# EAGLE design HitconBadge2018 (EAGLE 8.4.3)
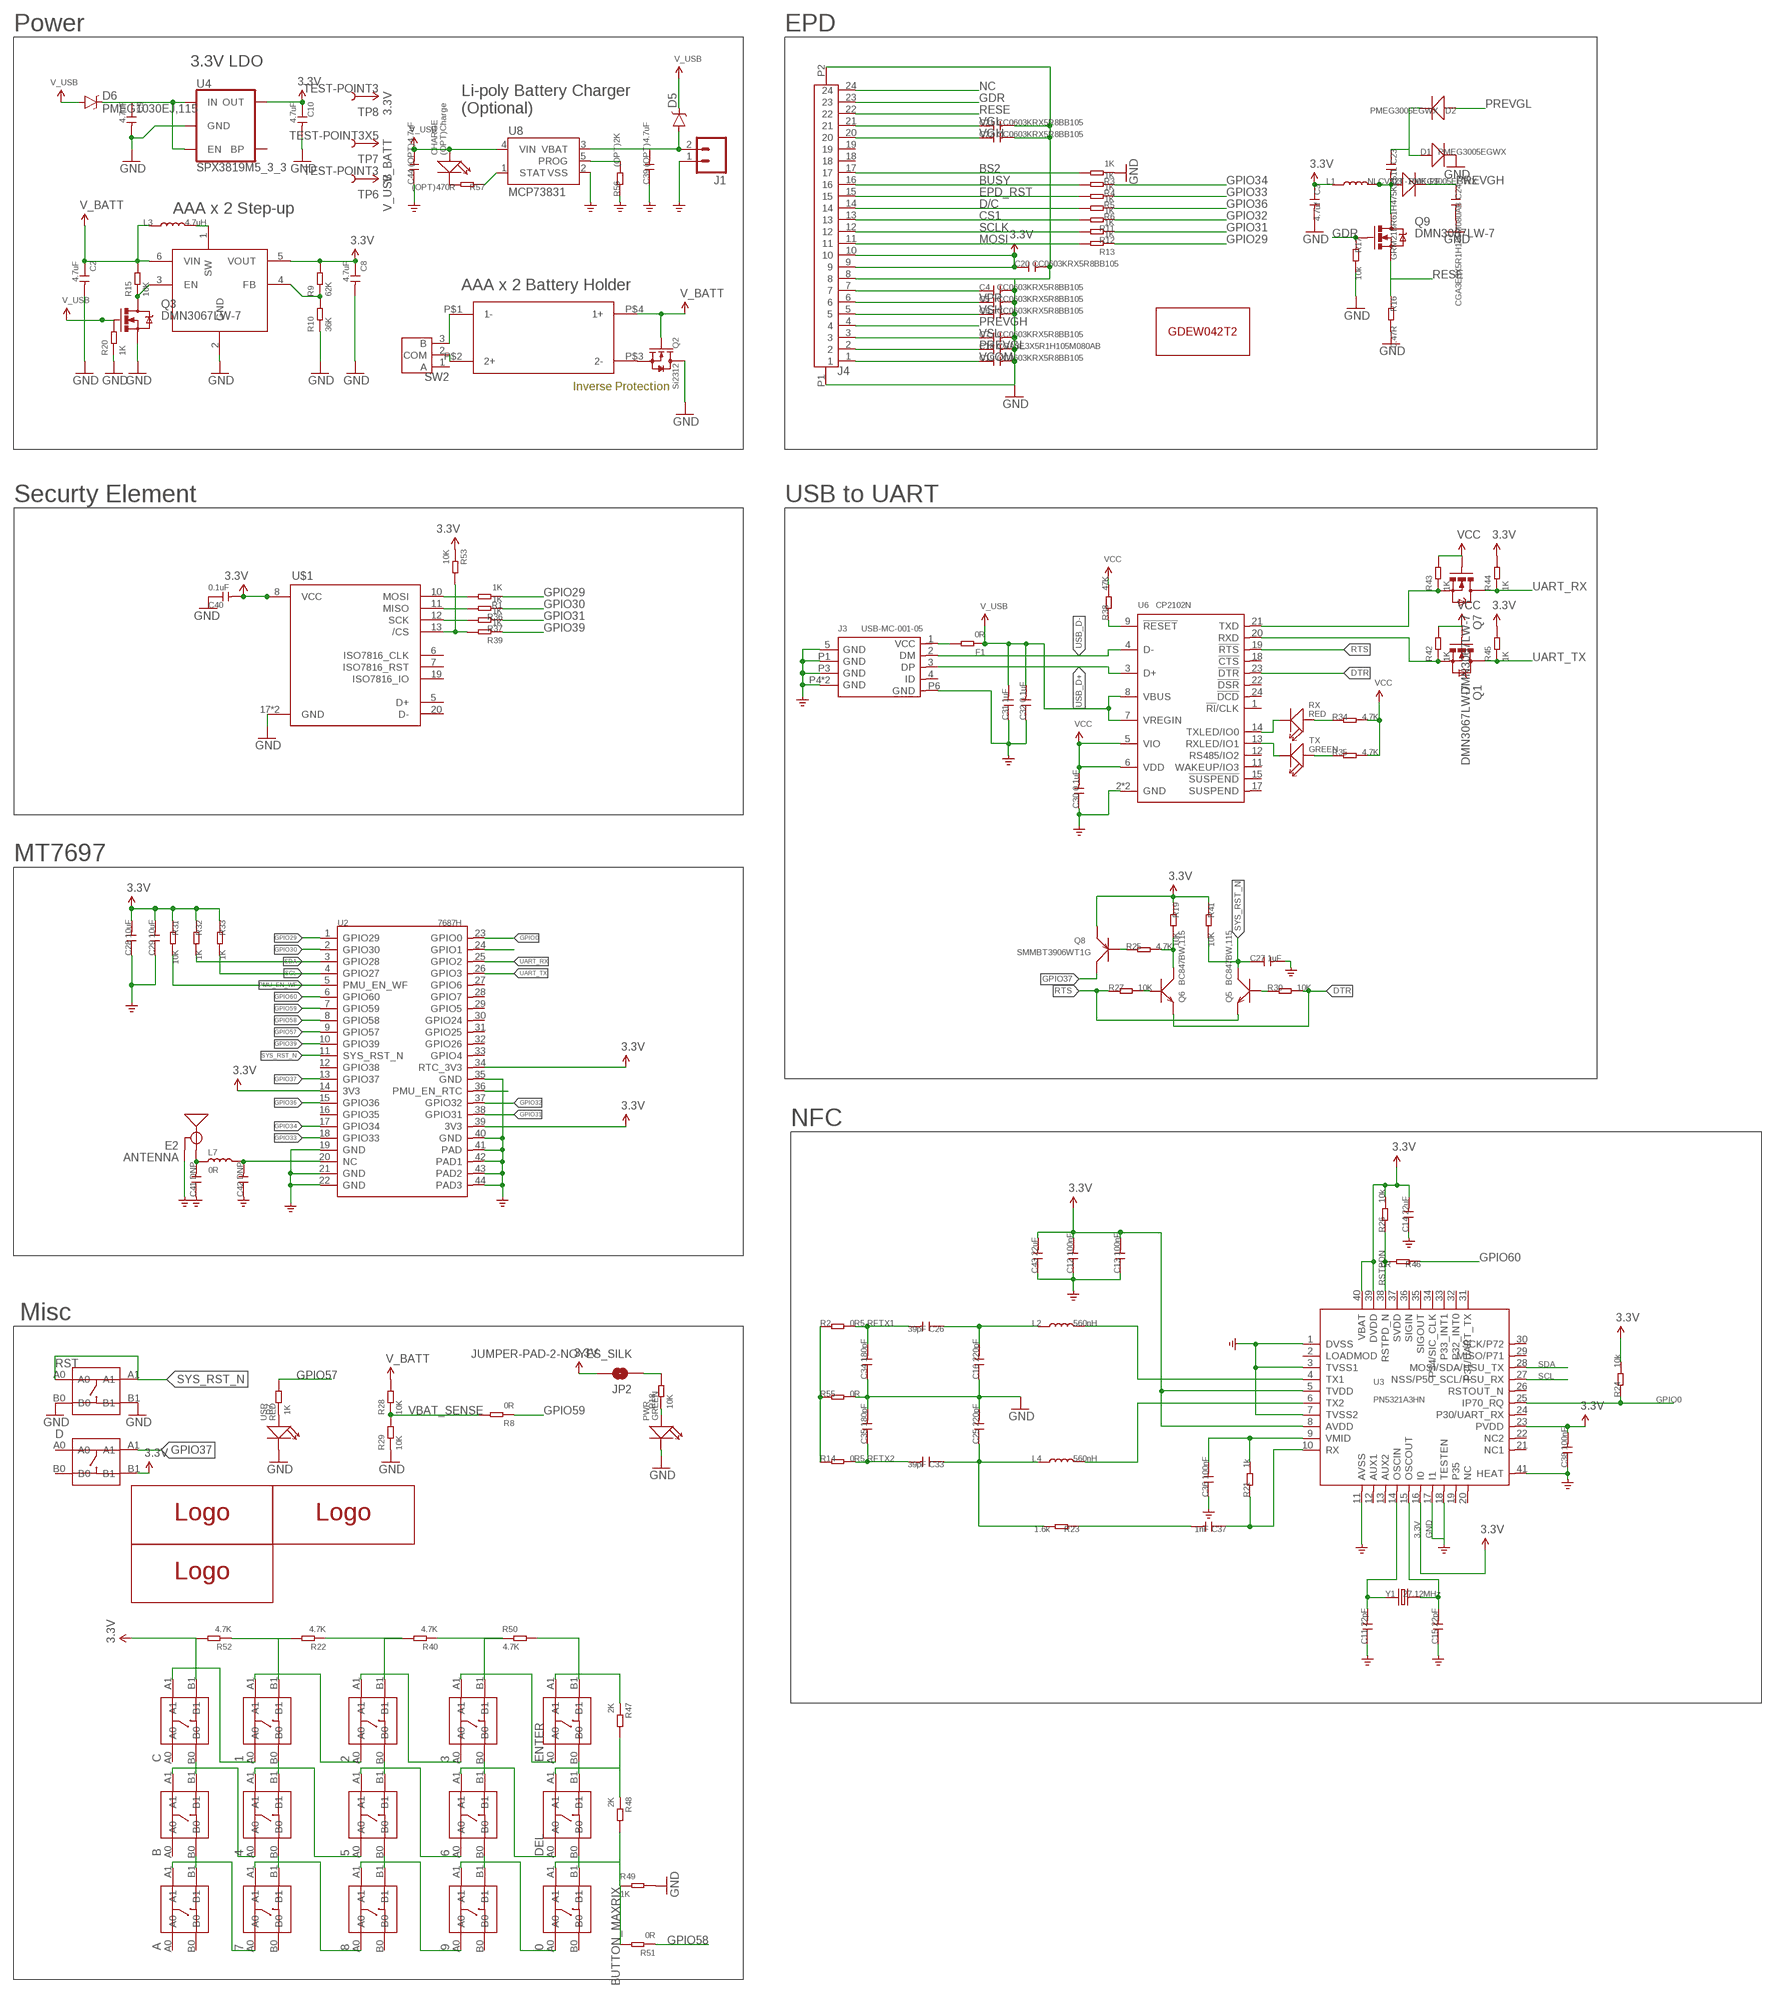
[diagram p0: schematic, sheet 1]

## Parts
0  BUTTON-4P-3.3X3.3  [4P-SMD-3.4X3.4X1.3H]
1  BUTTON-4P-3.3X3.3  [4P-SMD-3.4X3.4X1.3H]
2  BUTTON-4P-3.3X3.3  [4P-SMD-3.4X3.4X1.3H]
3  BUTTON-4P-3.3X3.3  [4P-SMD-3.4X3.4X1.3H]
4  BUTTON-4P-3.3X3.3  [4P-SMD-3.4X3.4X1.3H]
5  BUTTON-4P-3.3X3.3  [4P-SMD-3.4X3.4X1.3H]
6  BUTTON-4P-3.3X3.3  [4P-SMD-3.4X3.4X1.3H]
7  BUTTON-4P-3.3X3.3  [4P-SMD-3.4X3.4X1.3H]
8  BUTTON-4P-3.3X3.3  [4P-SMD-3.4X3.4X1.3H]
9  BUTTON-4P-3.3X3.3  [4P-SMD-3.4X3.4X1.3H]
A  BUTTON-4P-3.3X3.3  [4P-SMD-3.4X3.4X1.3H]
B  BUTTON-4P-3.3X3.3  [4P-SMD-3.4X3.4X1.3H]
C  BUTTON-4P-3.3X3.3  [4P-SMD-3.4X3.4X1.3H]
C2  4.7uF  CAP-0603  [C0603@1]
C3  4.7uf  C-0603  [C0603]
C4  CC0603KRX5R8BB105  C-0603  [C0603]
C5  CC0603KRX5R8BB105  C-0603  [C0603]
C6  CC0603KRX5R8BB105  C-0603  [C0603]
C7  CC0603KRX5R8BB105  C-0603  [C0603]
C8  4.7uF  CAP-0603  [C0603@1]
C9  4.7uF  CAP-0603  [C0603@1]
C10  4.7uF  CAP-0603  [C0603@1]
C11  22pF  C-0402  [C0402]
C12  100nF  C-0402  [C0402]
C13  100nF  C-0402  [C0402]
C14  22uF  C-0603  [C0603]
C15  22pF  C-0402  [C0402]
C16  220pF  C-0402  [C0402]
C18  CGA3E3X5R1H105M080AB  C-0603  [C0603]
C19  CC0603KRX5R8BB105  C-0603  [C0603]
C20  CC0603KRX5R8BB105  C-0603  [C0603]
C21  CC0603KRX5R8BB105  C-0603  [C0603]
C22  CC0603KRX5R8BB105  C-0603  [C0603]
C23  GRM21BR61H475KE51L  C-0805  [C0805]
C24  CGA3E3X5R1H105M080AB  C-0603  [C0603]
C25  220pF  C-0402  [C0402]
C26  39pF  C-0402  [C0402]
C27  1uF  C-0402  [C0402]
C28  10uF  C-0603  [C0603]
C29  10uF  C-0603  [C0603]
C30  0.1uF  C-0402  [C0402]
C31  1uF  C-0402  [C0402]
C32  0.1uF  C-0402  [C0402]
C33  39pF  C-0402  [C0402]
C34  180pF  C-0402  [C0402]
C35  180pF  C-0402  [C0402]
C36  100nF  C-0402  [C0402]
C37  1nF  C-0402  [C0402]
C38  100nF  C-0402  [C0402]
C39  (OPT)4.7uF  C-0603  [C0603]
C40  0.1uF  CAP-0402  [C0402@1]
C41  DNP  C-0402  [C0402]
C42  DNP  C-0402  [C0402]
C43  22uF  C-0603  [C0603]
C44  (OPT)4.7uF  C-0603  [C0603]
CHARGE  (OPT)Charge  LED'0603'  [LED-0603]
D  BUTTON-4P-3.3X3.3  [4P-SMD-3.4X3.4X1.3H]
D1  PMEG3005EGWX  D'1206'  [SOD123]
D2  PMEG3005EGWX  D'1206'  [SOD123]
D3  PMEG3005EGWX  D'1206'  [SOD123]
D5  (OPT)PMEG1030EJ,115  DIODE-SCHOTTKY-BAT20J  [SOD-323]
D6  PMEG1030EJ,115  DIODE-SCHOTTKY-BAT20J  [SOD-323]
DEL  BUTTON-4P-3.3X3.3  [4P-SMD-3.4X3.4X1.3H]
E2  ANTENNA  [2450AT18D0100E]
ENTER  BUTTON-4P-3.3X3.3  [4P-SMD-3.4X3.4X1.3H]
F1  0R  RES-0603  [R0603]
J1  M02-JST-2MM-SMT  [JST-2-SMD]
J3  USB-MC-001-05  MICRO-USB5+4P  [MICRO-USB5+5P-SMD-0.65-7.2X5.06MM]
J4  FPC-CONNECTOR-24P-0.5'ST-FPC-052024-B'  [24P-0.5]
JP2  JUMPER-PAD-2-NOYES_SILK  [PAD-JUMPER-2-NO_YES_SILK]
L1  NLCV32T-100K-PF  L'1813'  [1813@1]
L2  560nH  L'0603'  [L0603@1]
L3  4.7uH  L'1616BZ'  [1616BZ@1]
L4  560nH  L'0603'  [L0603@1]
L7  0R  INDUCTOR/FERRITE-BEAD-0402  [L0402]
PWR  GREEN  LED'0603'  [LED-0603]
Q1  DMN3067LW-7  MOSFET-NCHANNEL2N7002PW  [SOT323]
Q2  Si2312  MOSFET-N'SOT23'  [SOT23]
Q3  DMN3067LW-7  MOSFET-NCHANNEL2N7002PW  [SOT323]
Q5  BC847BW,115  TRANSISTOR-NPN-SOT323  [SOT-323]
Q6  BC847BW,115  TRANSISTOR-NPN-SOT323  [SOT-323]
Q7  DMN3067LW-7  MOSFET-NCHANNEL2N7002PW  [SOT323]
Q8  SMMBT3906WT1G  TRANSISTOR-PNP  [SOT-323]
Q9  DMN3067LW-7  MOSFET-NCHANNEL2N7002PW  [SOT323]
R1  1K  RES-0402  [R0402]
R2  0R5  R-0402  [R0402]
R3  1K  RES-0402  [R0402]
R4  1K  RES-0402  [R0402]
R5  1K  RES-0402  [R0402]
R6  1K  RES-0402  [R0402]
R7  1K  RES-0402  [R0402]
R8  0R  RES-0402  [R0402]
R9  62K  RES-0402  [R0402]
R10  36K  RES-0402  [R0402]
R11  1K  RES-0402  [R0402]
R12  1K  RES-0402  [R0402]
R13  1K  RES-0402  [R0402]
R14  0R5  R-0402  [R0402]
R15  10K  RES-0402  [R0402]
R16  0.47R  R-0402  [R0402]
R17  10k  R-0402  [R0402]
R18  10K  RES-0402  [R0402]
R19  10K  R-0402  [R0402]
R20  1K  RES-0402  [R0402]
R21  1k  R-0402  [R0402]
R22  4.7K  RES-0402  [R0402]
R23  1.6k  R-0402  [R0402]
R24  10k  R-0402  [R0402]
R25  4.7K  R-0402  [R0402]
R26  10k  R-0402  [R0402]
R27  10K  R-0402  [R0402]
R28  10K  RES-0402  [R0402]
R29  10K  RES-0402  [R0402]
R30  10K  R-0402  [R0402]
R31  10K  R-0402  [R0402]
R32  1K  R-0402  [R0402]
R33  1K  R-0402  [R0402]
R34  4.7K  R-0402  [R0402]
R35  4.7K  R-0402  [R0402]
R36  1K  RES-0402  [R0402]
R37  1K  RES-0402  [R0402]
R38  47K  R-0402  [R0402]
R39  1K  RES-0402  [R0402]
R40  4.7K  RES-0402  [R0402]
R41  10K  R-0402  [R0402]
R42  1K  RES-0402  [R0402]
R43  1K  RES-0402  [R0402]
R44  1K  RES-0402  [R0402]
R45  1K  RES-0402  [R0402]
R46  0R  R-0402  [R0402]
R47  2K  RES-0402  [R0402]
R48  2K  RES-0402  [R0402]
R49  1K  RES-0402  [R0402]
R50  4.7K  RES-0402  [R0402]
R51  0R  RES-0402  [R0402]
R52  4.7K  RES-0402  [R0402]
R53  10K  RES-0402  [R0402]
R55  0R  R-0402  [R0402]
R56  (OPT)2K  R-0402  [R0402]
R57  (OPT)470R  R-0402  [R0402]
RST  BUTTON-4P-3.3X3.3  [4P-SMD-3.4X3.4X1.3H]
RX  RED  LED'0603'  [LED-0603]
SW2  SWITCH-2H-3P'--'  [3P-2CH-3.54X8.5]
TP6  TEST-POINT3  [PAD.03X.03]
TP7  TEST-POINT3X5  [PAD.03X.05]
TP8  TEST-POINT3  [PAD.03X.03]
TX  GREEN  LED'0603'  [LED-0603]
U1  MCP1640  [SOT23-6]
U2  7687H  MODULE-SIP-AI7697H  [MODULE44P-1.6-18X18X1.3MM]
U3  PN5321A3HN  PN532-HVQFN40  [HVQFN40]
U4  SPX3819M5_3_3  V_REG_SPX3819-SOT23-5  [SOT23-5]
U6  CP2102N  CONVERTER-CP2102N(QFN24)  [QFN24G-0.5-4X4MM]
U8  MCP73831  [SOT23-5]
U$1  SLE97  [QFN-32]
U$2  HITCON_LOGOHITCON  [HITCON_LOGO]
U$3  HITCON_LOGOMEDIATEK  [MEDIATEK]
U$4  AAAX2  [AAAX2]
U$5  213  [213]
U$6  HITCON_LOGOIKV  [IKV]
USR  RED  LED'0603'  [LED-0603]
Y1  27.12MHz  CRYSTAL'3225'  [4P-SMD-3.2X2.5]

## Nets
3.3V: C3.1 C8.1 C10.1 C12.2 C13.2 C14.2 C20.1 C28.2 C29.2 C38.2 C40.2 C43.2 C.B1 D.B1 J4.9 J4.10 JP2.2 L1.1 Q8.2(E) R9.2 R19.1 R24.2 R26.2 R31.1 R32.1 R33.1 R41.1 R44.2 R45.2 R52.2 R53.1 TP8.P$1 U1.5(VOUT) U2.14(3V3) U2.34(RTC_3V3) U2.39(3V3) U3.5(TVDD) U3.8(AVDD) U3.16(I0) U3.23(PVDD) U3.39(DVDD) U3.40(VBAT) U4.5(OUT) U$1.8(VCC)
BS2: J4.17 R3.2
BUSY: J4.16 R4.2
BUTTON_MAXRIX: 0.A1 R48.2 R49.1 R51.2
CS1: J4.13 R11.2
D/C: J4.14 R6.2
DTR: Q6.2(E) R30.2 U6.23(!DTR!)
EPD_RST: J4.15 R5.2
GDR: J4.23 Q9.1(G) R17.1
GND: C2.2 C3.2 C4.2 C5.2 C6.2 C7.2 C8.2 C9.2 C10.2 C11.1 C12.1 C13.1 C14.1 C15.1 C16.1 C18.2 C19.2 C20.2 C21.2 C22.2 C24.2 C25.2 C27.2 C28.1 C29.1 C30.1 C31.1 C32.1 C34.1 C35.2 C36.1 C38.1 C39.1 C40.1 C41.1 C42.1 C43.1 C44.1 D1.- E2.GND@1(GND) E2.GND@2(GND) E2.GND@3(GND) J1.1 J3.5(GND) J3.P1(GND) J3.P3(GND) J3.P4(GND) J3.P5(GND) J3.P6(GND) J4.8 J4.P1 J4.P2 PWR.- Q2.3(D) Q3.2(S) R3.1 R10.1 R16.2 R17.2 R20.1 R29.1 R49.2 R55.2 R56.1 RST.B0 RST.B1 U1.2(GND) U2.19(GND) U2.21(GND) U2.22(GND) U2.35(GND) U2.40(GND) U2.41(PAD) U2.42(PAD1) U2.43(PAD2) U2.44(PAD3) U3.1(DVSS) U3.3(TVSS1) U3.7(TVSS2) U3.11(AVSS) U3.17(I1) U3.18(TESTEN) U3.41(HEAT) U4.2(GND) U6.2(GND) U6.PAD(GND) U8.2(VSS) U$1.17(GND) U$1.EP(GND) USR.- ; supply symbol labelled GND_POWER
GPIO0: R24.1 U2.23(GPIO0) U3.25(IP70_RQ)
GPIO29: R1.1 R13.1 U2.1(GPIO29)
GPIO30: R36.1 U2.2(GPIO30)
GPIO31: R12.1 R37.1 U2.38(GPIO31)
GPIO32: R11.1 U2.37(GPIO32)
GPIO33: R5.1 U2.18(GPIO33)
GPIO34: R4.1 U2.17(GPIO34)
GPIO36: R6.1 U2.15(GPIO36)
GPIO37: D.A1 Q8.3(C) U2.13(GPIO37)
GPIO39: R39.1 U2.10(GPIO39)
GPIO57: R7.2 U2.9(GPIO57)
GPIO58: R51.1 U2.8(GPIO58)
GPIO59: R8.1 U2.7(GPIO59)
GPIO60: R46.1 U2.6(GPIO60)
MOSI: J4.11 R13.2
N$1: C11.2 U3.14(OSCIN) Y1.2
N$2: L3.2 U1.1(SW)
N$3: U2.24(GPIO1)
N$4: C23.1 D1.+ D2.-
N$5: SW2.3(B) U$4.P$1(1-)
N$6: R7.1 USR.+
N$7: R9.1 R10.2 U1.4(FB)
N$8: Q3.3(D) R15.1 U1.3(EN)
N$9: C15.2 U3.15(OSCOUT) Y1.4
N$10: L4.2 U3.6(TX2)
N$11: L2.2 U3.4(TX1)
N$12: C4.1 J4.7
N$13: C16.2 C26.1 L2.1
N$14: C23.2 D3.+ L1.2 Q9.3(D)
N$15: C25.1 C33.1 L4.1 R23.2
N$16: C36.2 R21.2 U3.9(VMID)
N$17: C37.1 R21.1 U3.10(RX)
N$18: C37.2 R23.1
N$19: 4.B0 7.B1
N$20: C41.2 E2.FEED(SIGNAL) L7.1
N$21: 1.B0 4.B1
N$22: SW2.2(COM) U$4.P$2(2+)
N$23: C9.1 D6.C U4.1(IN) U4.3(EN)
N$24: R56.2 U8.5(PROG)
N$25: 5.B0 8.B1
N$26: C42.2 L7.2 U2.20(NC)
N$27: R1.2 U$1.10(MOSI)
N$28: R36.2 U$1.11(MISO)
N$29: R37.2 U$1.12(SCK)
N$30: R39.2 R53.2 U$1.13(/CS)
N$32: 2.B0 5.B1
N$33: 2.B1 R22.1 R40.2
N$34: 6.B0 9.B1
N$35: 3.B0 6.B1
N$36: 3.B1 R40.1 R50.1
N$37: 0.B1 DEL.B0
N$38: DEL.B1 ENTER.B0
N$39: ENTER.B1 R50.2
N$40: PWR.+ R18.1
N$41: JP2.1 R18.2
N$42: F1.2 J3.1(VCC)
N$43: Q5.1(B) R30.1
N$44: Q6.1(B) R27.2
N$45: Q6.3(C) R19.2 R25.2
N$46: Q8.1(B) R25.1
N$47: R35.1 TX.+
N$48: R34.1 RX.+
N$49: TX.- U6.13(RXLED/IO1)
N$50: RX.- U6.14(TXLED/IO0)
N$51: R38.1 U6.9(!RESET!)
N$52: Q1.2(S) R42.1 U6.20(RXD)
N$53: Q7.2(S) R43.1 U6.21(TXD)
N$54: 6.A1 DEL.A0
N$55: 3.A1 ENTER.A0
N$56: 7.A1 8.A0
N$57: 8.A1 9.A0
N$58: 0.A0 9.A1
N$59: 4.A1 5.A0
N$60: 5.A1 6.A0
N$61: DEL.A1 R47.2 R48.1
N$62: 1.A1 2.A0
N$63: 2.A1 3.A0
N$64: ENTER.A1 R47.1
N$65: R2.1 R14.1 R55.1
N$66: Q2.2(S) U$4.P$3(2-)
N$69: R57.1 U8.1(STAT)
N$70: CHARGE.- R57.2
N$71: 1.B1 R22.2 R52.1
N$72: C39.2 D5.A J1.2 U8.3(VBAT)
N$74: B.B1 C.B0
N$75: A.B1 B.B0
N$76: 7.A0 A.A1
N$77: 4.A0 B.A1
N$78: 1.A0 C.A1
NC: J4.24
PMU_EN_RTC: U2.36(PMU_EN_RTC)
PMU_EN_WF: R31.2 U2.5(PMU_EN_WF)
PREVGH: C24.1 D3.- J4.4
PREVGL: C18.1 D2.+ J4.2
RESE: J4.22 Q9.2(S) R16.1
RFTX1: C26.2 C34.2 R2.2
RFTX2: C33.2 C35.1 R14.2
RSTPDN: R26.1 R46.2 U3.38(RSTPD_N)
RTS: Q5.2(E) R27.1 U6.19(!RTS!)
SCL: R33.2 U2.4(GPIO27) U3.27(NSS/P50_SCL/HSU_RX)
SCLK: J4.12 R12.2
SDA: R32.2 U2.3(GPIO28) U3.28(MOSI/SDA/HSU_TX)
SYS_RST_N: C27.1 Q5.3(C) R41.2 RST.A0 RST.A1 U2.11(SYS_RST_N)
UART_RX: Q7.3(D) R44.1 U2.25(GPIO2)
UART_TX: Q1.3(D) R45.1 U2.26(GPIO3)
USB_D+: J3.3(DP) U6.3(D+)
USB_D-: J3.2(DM) U6.4(D-)
V_BATT: C2.1 L3.1 Q2.1(G) R15.2 R28.2 TP7.P$1 U1.6(VIN) U$4.P$4(1+)
V_USB: C31.2 C32.2 C44.2 CHARGE.+ D5.C D6.A F1.1 Q3.1(G) R20.2 TP6.P$1 U6.7(VREGIN) U6.8(VBUS) U8.4(VIN)
VBAT_SENSE: R8.2 R28.1 R29.2
VCC: C30.2 Q1.1(G) Q7.1(G) R34.2 R35.2 R38.2 R42.2 R43.2 U6.5(VIO) U6.6(VDD)
VCOM: C19.1 J4.1
VGH: C22.1 J4.20
VGL: C21.1 J4.21
VPP: C5.1 J4.6
VSH: C6.1 J4.5
VSL: C7.1 J4.3
Unconnected: 0.B0 7.B0 8.B0 9.B0 A.A0 A.B0 B.A0 C.A0 D.A0 D.B0 J3.4(ID) J4.18 J4.19 SW2.1(A) U2.12(GPIO38) U2.16(GPIO35) U2.27(GPIO6) U2.28(GPIO7) U2.29(GPIO5) U2.30(GPIO24) U2.31(GPIO25) U2.32(GPIO26) U2.33(GPIO4) U3.2(LOADMOD) U3.12(AUX1) U3.13(AUX2) U3.19(P35) U3.20(NC) U3.21(NC1) U3.22(NC2) U3.24(P30/UART_RX) U3.26(RSTOUT_N) U3.29(MISO/P71) U3.30(SCK/P72) U3.31(P31/UART_TX) U3.32(P32_INT0) U3.33(P33_INT1) U3.34(P34/SIC_CLK) U3.35(SIGOUT) U3.36(SIGIN) U3.37(SVDD) U4.4(BP) U6.1(!RI!/CLK) U6.11(WAKEUP/IO3) U6.12(RS485/IO2) U6.15(!SUSPEND!) U6.17(SUSPEND) U6.18(!CTS!) U6.22(!DSR!) U6.24(!DCD!) U$1.5(D+) U$1.6(ISO7816_CLK) U$1.7(ISO7816_RST) U$1.19(ISO7816_IO) U$1.20(D-)

## Notes on the sheet
- Power | EPD
- 3.3V LDO
- Li-poly Battery Charger
  (Optional)
- AAA x 2 Step-up
- AAA x 2 Battery Holder
- Inverse Protection
- Securty Element | USB to UART
- MT7697
- NFC
- Misc

## Library data of the parts
0 1-9 A B C D DEL ENTER RST = Discrete:BUTTON-4P
C2 C8-C10 C40 = Discrete:CAP: Ceramic Capacitors
C3-C7 C11-C16 C18-C39 C41-C44 = Discrete:C*: Ceramic Capacitors
CHARGE PWR RX TX USR = Discrete-small:LED
D1-D3 = Discrete:D*
D5 D6 = SparkFun-DiscreteSemi:DIODE-SCHOTTKY: Schottky diodes in SFE's production catalog BAT20J 1A 23V 0.62Vf RB751 120mA 40V 0.37Vf PMEG4005EJ 0.5A 40V 0.42Vf MBRA140 1A 40V 0.5Vf B340A 3A 40V SMA; PROD_ID: DIO-11623; VALUE: BAT20J
E2 = SparkFun-RF:ANTENNA: Chip antenna Chip antenna with ground or secondary connection. Common with larger metal RF connectors.
F1 R1 R3-R13 R15 R18 R20 R22 R28 R29 R36 R37 R39 R40 R42-R45 R47-R53 = Seeed-OPL-Resistor:RES
J1 = SparkFun-Connectors:M02: Standard 2-pin 0.1" header. Use with - straight break away headers ( PRT-00116) - right angle break away headers (PRT-00553) - swiss pins (PRT-00743) - machine pins (PRT-00117) - female headers (PRT-00115) Molex polarized connector foot print use with: PRT-08233 with associated crimp pins and housings. 2.54_SCREWTERM for use with PRT-10571. 3.5mm Screw Terminal footprints for PRT-08084 5mm Screw Terminal footprints for use with PRT-08432; PROD_ID: CONN-11443
J3 = Connector-new:MICRO-USB5+4P: 5+4P-SMD-0.65-B:320010000;5+2P-SMD-0.65-AB:340032001;5+5P-SMD-0.65-7.2X5.06MM:320010050;
J4 = Connector :FPC-CONNECTOR-24P-0.5
JP2 = SparkFun-Passives:JUMPER-PAD-2-NO
L1-L4 = Discrete:L*
L7 = Discrete:INDUCTOR/FERRITE-BEAD
Q1 Q3 Q7 Q9 = SparkFun-DiscreteSemi:MOSFET-NCHANNEL: Common NMOSFET Parts MFG P/N Store ID Prod ID FDD8780 TRANS-09984 SI7820DN TRANS-11055 FDS6630A IC-08089 2N7002PW TRANS-11151 FQP30N06L COM-10213 TRANS-10060 BSS123LT1G TRANS-08345 BSS138 TRANS-00830 BS170 2N7000; PROD_ID: TRANS-11151
Q2 = Discrete:MOSFET-N: IRLL014: http://www.vishay.com/docs/91319/sihll014.pdf
Q5 Q6 = Discrete-new:TRANSISTOR-NPN: NPN audion
Q8 = Discrete-new:TRANSISTOR-PNP: PNP audion
R2 R14 R16 R17 R19 R21 R23-R27 R30-R35 R38 R41 R46 R55-R57 = Discrete:R*
SW2 = Discrete:SWITCH-2H-3P
TP6-TP8 = SparkFun-Passives:TEST-POINT: Bare copper test points for troubleshooting or ICT
U1 = IC:MCP1640
U2 = template:MODULE-SIP-AI7697H
U3 = IC:PN532: NFC Controller http://www.adafruit.com/datasheets/pn532ds.pdf
U4 = SparkFun-IC-Power:V_REG_SPX3819: SPX3819 Voltage Regulator 3.3V 500mA, 16V input Datasheet <https://www.exar.com/content/document.ashx?id=22106> SparkFun Products: SparkFun Serial Controlled Motor Driver <https://www.sparkfun.com/products/13911>; PROD_ID: VREG-13321
U6 = template:CONVERTER-CP2102N(QFN24)
U8 = SparkFun-PowerIC:MCP73831: Miniature single cell, fully integrated Li-Ion, Li-polymer charge management controller http://ww1.microchip.com/downloads/en/DeviceDoc/20001984g.pdf IC-09995; PROD_ID: IC-09995
U$1 = SparkFun-DigitalIC:SLE97
U$2 U$3 U$6 = logo:HITCON_LOGO
U$4 = Battery:AAAX2
U$5 = EDP:213
Y1 = Discrete:CRYSTAL*: CRYSTAL

## Net classes
1 Power: width 0.762 mm

## Board
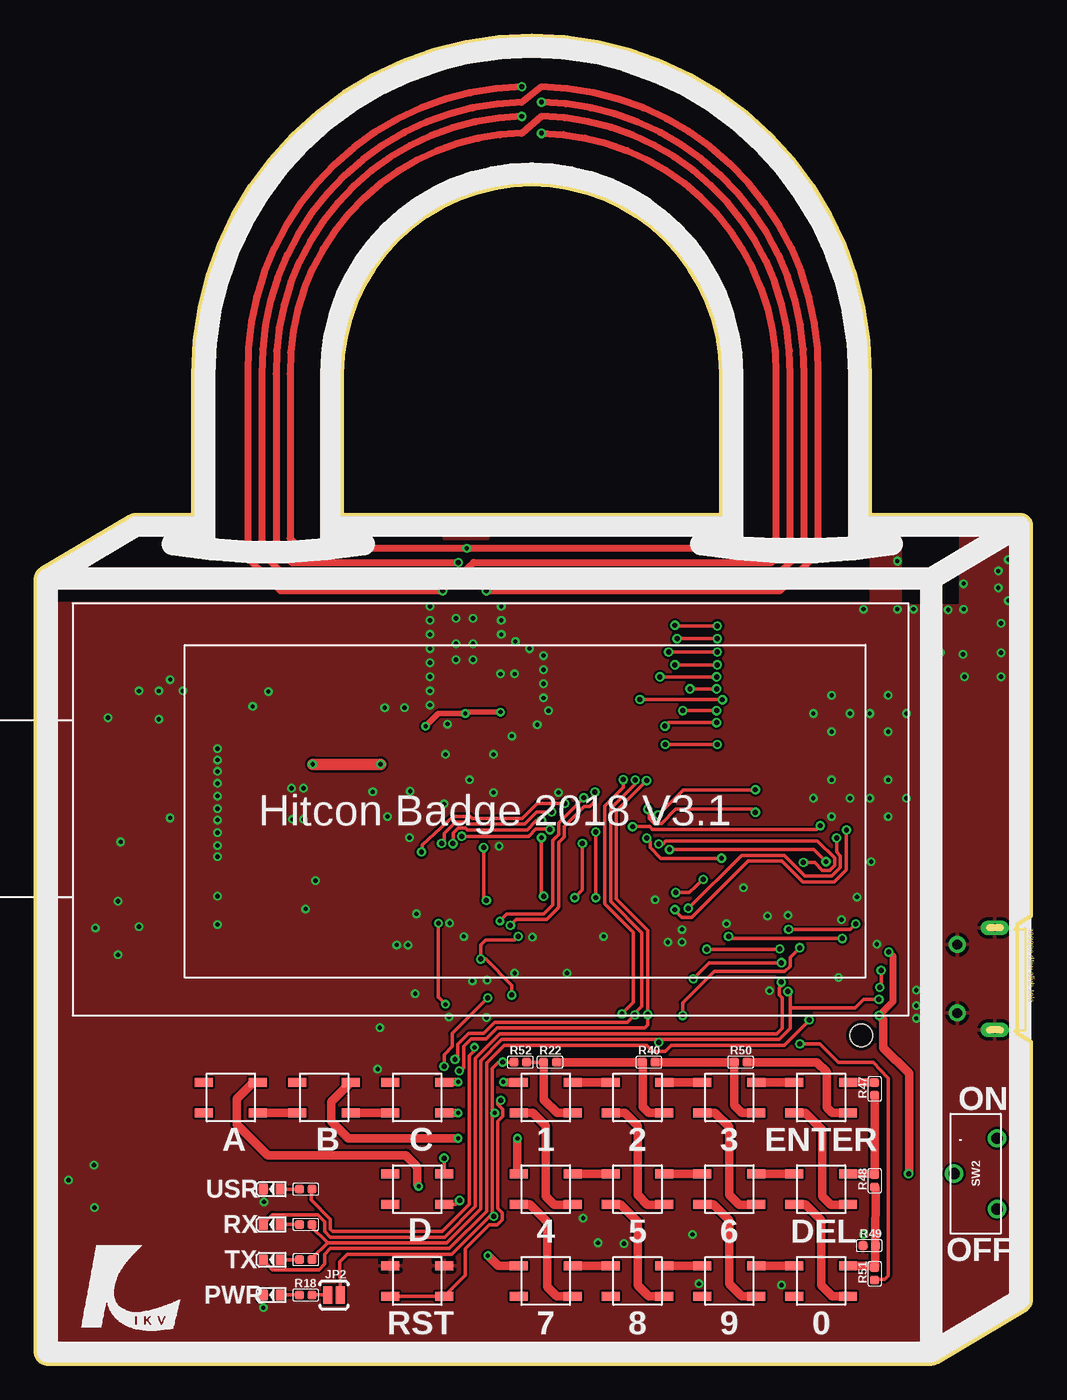
[diagram p1: board, top side]
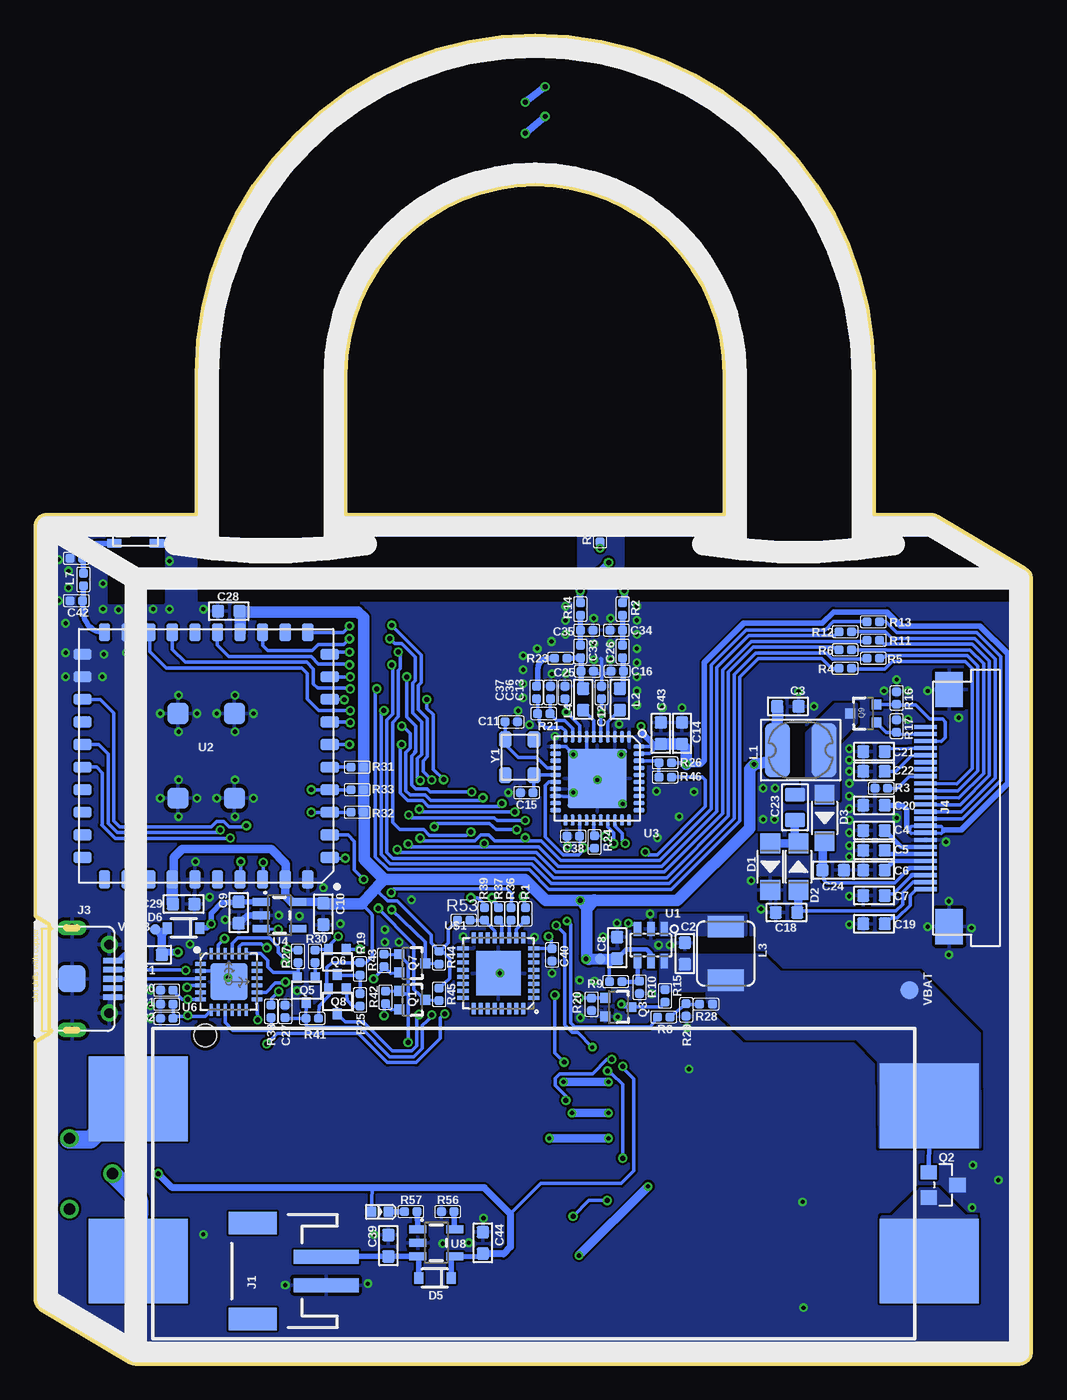
[diagram p2: board, bottom side, seen from below]

Size 70.55 x 94.15 mm. Coordinates in mm from the lower left corner, seen from the top.
Outline: 6.65,60.05 0.5,56.4 arc65 0,55.6 0,0.9 arc90 0.9,0 63.25,0 arc32 63.9,0.15 70.2,3.9 arc56 70.55,4.65 70.55,22.85 69.55,23.45 69.55,31.15 70.55,31.75 70.55,59.4 arc90 69.7,60.2 59.15,60.2 59.15,70.15 arc180 11.15,70.15 11.15,60.2 7.15,60.2 arc32 6.65,60.05
Outline: 48.55,60.2 21.75,60.2 21.75,70.15 arc-180 48.55,70.15 48.55,60.2
Copper layers (1*16): Top 0.035mm / dielectric 1.5mm / Bottom 0.035mm
Design rules "SeeedStudio_2layer_DRU_no_angle_20140221 *": minimum track width 6mil, minimum drill 0.3mm, track to track 6mil, track to pad 6mil, pad to pad 6mil, via to via 6mil, smd to smd 0mil, copper to edge 10mil, drill to drill 10mil, minimum pad ring 10mil, minimum via ring 6mil, stop-mask expansion 2mil, vias tented up to drill 100mil, thermal gap 10mil
tRestrict: area 61.5,54 to 65.3,60.2
bRestrict: area 61.5,54 to 65.3,60.2; area 19.6,29.2 to 23.7,30.2; area 16.1,41.5 to 17.1,45.6

### Footprints (pad centres in the part's own frame; a part is rotated, then mirrored left to right if it is on the bottom)
4P-SMD-3.4X3.4X1.3H = smd 1.27 x 0.635: A0 -1.905,1.079; A1 1.905,1.079; B0 -1.905,-1.079; B1 1.905,-1.079
C0603@1 = smd 0.889 x 0.889: 1 -0.762,0; 2 0.762,0
C0603 = smd 0.889 x 0.889: 1 -0.762,0; 2 0.762,0
C0402 = smd 0.635 x 0.635: 1 -0.445,0; 2 0.445,0
C0805 = smd 1.016 x 1.397: 1 -0.889,0; 2 0.889,0
C0402@1 = smd 0.635 x 0.635: 1 -0.445,0; 2 0.445,0
LED-0603 = smd 0.696 x 0.762: + -0.602,0; - 0.602,0
SOD123 = smd 1.397 x 1.397: + -1.651,0; - 1.651,0
SOD-323 = smd 0.63 x 0.83: A 1.15,0; C -1.15,0
2450AT18D0100E = smd 1 x 0.6: FEED 0.5,0.25; GND@1 0.5,1.55; GND@2 3.5,1.55; GND@3 3.5,0.25
R0603 = smd 0.889 x 0.889: 1 0,0.762; 2 0,-0.762
JST-2-SMD = smd 1 x 4.6: 1 -1,-3.7; 2 1,-3.7 | smd 1.6 x 3.4: NC1 -3.4,1.5; NC2 3.4,1.5
MICRO-USB5+5P-SMD-0.65-7.2X5.06MM = smd 0.4 x 1.35: 1 -1.3,2.875; 2 -0.65,2.875; 3 0,2.875; 4 0.65,2.875; 5 1.3,2.875 | smd 1.9 x 1.9: P1 0,0 | drill 0.508 pad 1.016 long: P3 -3.625,0; P4 3.625,0 | drill 0.7: P5 -2.425,2.65; P6 2.425,2.65
24P-0.5 = smd 0.3 x 1.6: 1 -5.75,0.05; 2 -5.25,0.05; 3 -4.75,0.05; 4 -4.25,0.05; 5 -3.75,0.05; 6 -3.25,0.05; 7 -2.75,0.05; 8 -2.25,0.05; 9 -1.75,0.05; 10 -1.25,0.05; 11 -0.75,0.05; 12 -0.25,0.05; 13 0.25,0.05; 14 0.75,0.05; 15 1.25,0.05; 16 1.75,0.05; 17 2.25,0.05; 18 2.75,0.05; 19 3.25,0.05; 20 3.75,0.05; 21 4.25,0.05; 22 4.75,0.05; 23 5.25,0.05; 24 5.75,0.05 | smd 2.5 x 1.95: P1 -8.4,-1.625; P2 8.4,-1.625
PAD-JUMPER-2-NO_YES_SILK = smd 0.635 x 1.27: 1 -0.45,0; 2 0.45,0
1813@1 = smd 1.778 x 3.81: 1 -1.651,0; 2 1.651,0
L0603@1 = smd 0.889 x 0.889: 1 -0.762,0; 2 0.762,0
1616BZ@1 = smd 1.524 x 2.54: 1 -1.905,0; 2 1.905,0
L0402 = smd 0.635 x 0.635: 1 -0.445,0; 2 0.445,0
SOT323 = smd 0.7 x 0.7: 1 -0.65,-0.925; 2 0.65,-0.925; 3 0,0.925
SOT23 = smd 1.016 x 1.143: 1 -0.889,-1.016; 2 0.889,-1.016; 3 0,1.016
SOT-323 = smd 0.635 x 0.762: 1 -0.635,-0.889; 2 0.635,-0.889; 3 0,0.889
R0402 = smd 0.635 x 0.635: 1 0,0.445; 2 0,-0.445
R0402' = smd 0.635 x 0.635: 1 -0.445,0; 2 0.445,0
3P-2CH-3.54X8.5 = drill 0.8 pad 1.3: 1 -2.5,-1.52; 2 0,1.52; 3 2.5,-1.52
PAD.03X.03 = smd 0.762 x 0.762: P$1 0,0
PAD.03X.05 = smd 1.27 x 1.27: P$1 0,0
SOT23-6 = smd 0.508 x 1.016: 1 -0.95,-1.143; 2 0,-1.143; 3 0.95,-1.143; 4 0.95,1.143; 5 0,1.143; 6 -0.95,1.143
MODULE44P-1.6-18X18X1.3MM = smd 1.3 x 0.8: 1 -8.75,7.2; 2 -8.75,5.6; 3 -8.75,4; 4 -8.75,2.4; 5 -8.75,0.8; 6 -8.75,-0.8; 7 -8.75,-2.4; 8 -8.75,-4; 9 -8.75,-5.6; 10 -8.75,-7.2; 21 8.75,-7.2; 22 8.75,-5.6; 23 8.75,-4; 24 8.75,-2.4; 25 8.75,-0.8; 26 8.75,0.8; 27 8.75,2.4; 28 8.75,4; 29 8.75,5.6; 30 8.75,7.2 | smd 0.8 x 1.3: 11 -7.2,-8.75; 12 -5.6,-8.75; 13 -4,-8.75; 14 -2.4,-8.75; 15 -0.8,-8.75; 16 0.8,-8.75; 17 2.4,-8.75; 18 4,-8.75; 19 5.6,-8.75; 20 7.2,-8.75; 31 7.2,8.75; 32 5.6,8.75; 33 4,8.75; 34 2.4,8.75; 35 0.8,8.75; 36 -0.8,8.75; 37 -2.4,8.75; 38 -4,8.75; 39 -5.6,8.75; 40 -7.2,8.75 | smd 1.5 x 1.5: 41 -2,3; 42 -2,-3; 43 2,-3; 44 2,3
HVQFN40 = smd 0.8 x 0.3: 1 -2.95,2.25; 2 -2.95,1.75; 3 -2.95,1.25; 4 -2.95,0.75; 5 -2.95,0.25; 6 -2.95,-0.25; 7 -2.95,-0.75; 8 -2.95,-1.25; 9 -2.95,-1.75; 10 -2.95,-2.25; 21 2.95,-2.25; 22 2.95,-1.75; 23 2.95,-1.25; 24 2.95,-0.75; 25 2.95,-0.25; 26 2.95,0.25; 27 2.95,0.75; 28 2.95,1.25; 29 2.95,1.75; 30 2.95,2.25 | smd 0.3 x 0.8: 11 -2.25,-2.95; 12 -1.75,-2.95; 13 -1.25,-2.95; 14 -0.75,-2.95; 15 -0.25,-2.95; 16 0.25,-2.95; 17 0.75,-2.95; 18 1.25,-2.95; 19 1.75,-2.95; 20 2.25,-2.95; 31 2.25,2.95; 32 1.75,2.95; 33 1.25,2.95; 34 0.75,2.95; 35 0.25,2.95; 36 -0.25,2.95; 37 -0.75,2.95; 38 -1.25,2.95; 39 -1.75,2.95; 40 -2.25,2.95 | smd 4.2 x 4.2: 41 0,0
SOT23-5 = smd 0.55 x 1.2: 1 -0.95,-1.3; 2 0,-1.3; 3 0.95,-1.3; 4 0.95,1.3; 5 -0.95,1.3
QFN24G-0.5-4X4MM = smd 0.8 x 0.26: 1 -2,1.25; 2 -2,0.75; 3 -2,0.25; 4 -2,-0.25; 5 -2,-0.75; 6 -2,-1.25; 13 2,-1.25; 14 2,-0.75; 15 2,-0.25; 16 2,0.25; 17 2,0.75; 18 2,1.25 | smd 0.26 x 0.8: 7 -1.25,-2; 8 -0.75,-2; 9 -0.25,-2; 10 0.25,-2; 11 0.75,-2; 12 1.25,-2; 19 1.25,2; 20 0.75,2; 21 0.25,2; 22 -0.25,2; 23 -0.75,2; 24 -1.25,2 | smd 2.6 x 2.6: PAD 0.02,-0.01
QFN-32 = smd 0.285 x 0.8: 1 -1.75,-2.5; 2 -1.25,-2.5; 3 -0.75,-2.5; 4 -0.25,-2.5; 5 0.25,-2.5; 6 0.75,-2.5; 7 1.25,-2.5; 8 1.75,-2.5; 17 1.75,2.5; 18 1.25,2.5; 19 0.75,2.5; 20 0.25,2.5; 21 -0.25,2.5; 22 -0.75,2.5; 23 -1.25,2.5; 24 -1.75,2.5 | smd 0.8 x 0.285: 9 2.5,-1.75; 10 2.5,-1.25; 11 2.5,-0.75; 12 2.5,-0.25; 13 2.5,0.25; 14 2.5,0.75; 15 2.5,1.25; 16 2.5,1.75; 25 -2.5,1.75; 26 -2.5,1.25; 27 -2.5,0.75; 28 -2.5,0.25; 29 -2.5,-0.25; 30 -2.5,-0.75; 31 -2.5,-1.25; 32 -2.5,-1.75 | smd 3.15 x 3.15: EP 0,0
AAAX2 = smd 7 x 6: P$1 -1,17; P$2 -1,5.5; P$3 55,5.5; P$4 55,16.5 | hole 1.6: 3.75,21.5
4P-SMD-3.2X2.5 = smd 1.143 x 0.889: 1 -1.27,1.016; 2 -1.27,-1.016; 3 1.27,-1.016; 4 1.27,1.016

### Placement (x,y rotation side)
0  55.65,5.9 0 top
1  36.15,18.9 0 top
2  42.65,18.9 0 top
3  49.15,18.9 0 top
4  36.15,12.4 0 top
5  42.65,12.4 0 top
6  49.15,12.4 0 top
7  36.15,5.9 0 top
8  42.65,5.9 0 top
9  49.15,5.9 0 top
A  13.85,18.9 0 top
B  20.45,18.9 0 top
C  27.05,18.9 0 top
C2  24.55,29.1 90 bottom
C3  17.25,46.6 0 bottom
C4  11.15,37.8 180 bottom
C5  11.15,36.4 180 bottom
C6  11.15,35 180 bottom
C7  11.15,33.2 180 bottom
C8  29.35,29.5 90 bottom
C9  56.15,32 270 bottom
C10  50.15,31.9 270 bottom
C11  36.85,45.5 180 bottom
C12  30.45,47.6 270 bottom
C13  33.05,47.6 270 bottom
C14  24.75,44.7 270 bottom
C15  35.75,40.5 0 bottom
C16  29.35,49.1 0 bottom
C18  17.35,32 180 bottom
C19  11.15,31.2 180 bottom
C20  11.15,39.6 180 bottom
C21  11.15,43.4 180 bottom
C22  11.15,42 180 bottom
C23  16.75,39.45 90 bottom
C24  14.05,35 0 bottom
C25  31.45,49.1 0 bottom
C26  28.95,50.5 90 bottom
C27  52.85,25 90 bottom
C28  56.85,53.35 0 bottom
C29  60.05,32.6 180 bottom
C30  61.25,26.5 0 bottom
C31  61.25,25.5 0 bottom
C32  61.25,24.5 0 bottom
C33  31.95,50.5 90 bottom
C34  29.4,52 0 bottom
C35  31.5,52 0 bottom
C36  34.05,47.6 270 bottom
C37  35.05,47.6 90 bottom
C38  32.45,37.4 0 bottom
C39  45.55,8.4 270 bottom
C40  33.95,29 90 bottom
C41  67.65,57.1 0 bottom
C42  67.65,54.1 0 bottom
C43  26.25,44.7 270 bottom
C44  38.85,8.6 270 bottom
CHARGE  46.15,10.8 0 bottom
D  27.05,12.4 0 top
D1  18.5,35.25 270 bottom
D2  16.5,35.25 90 bottom
D3  14.65,38.7 270 bottom
D5  42.25,6.1 180 bottom
D6  60.05,30.9 180 bottom
DEL  55.65,12.4 0 top
E2  65.45,57.9 0 bottom
ENTER  55.65,18.9 0 top
F1  62.35,29 270 bottom
J1  53.65,6.6 90 bottom
J3  67.95,27.3 270 bottom
J4  7.45,39.4 90 bottom
JP2  21.15,4.9 0 top
L1  16.35,43.5 0 bottom
L2  29.15,47.1 270 bottom
L3  21.65,29.1 90 bottom
L4  31.75,47.1 270 bottom
L7  67.15,55.6 270 bottom
PWR  16.75,4.9 180 top
Q1  43.85,25.8 270 bottom
Q2  6.25,12.7 270 bottom
Q3  29.25,25.3 270 bottom
Q5  51.35,26.5 180 bottom
Q6  49.15,28.5 180 bottom
Q7  43.85,28.4 270 bottom
Q8  49.15,25.7 180 bottom
Q9  11.9,46.1 90 bottom
R1  35.85,31.9 0 bottom
R2  0R5  [R0402']  28.95,53.5 270 bottom
R3  10.65,40.8 90 bottom
R4  13.2,49.3 90 bottom
R5  11.2,50 90 bottom
R6  13.2,50.6 90 bottom
R7  19.15,12.4 90 top
R8  26.05,24.6 90 bottom
R9  29.45,27.1 270 bottom
R10  27.75,26.7 180 bottom
R11  11.2,51.3 90 bottom
R12  13.2,51.9 90 bottom
R13  11.2,52.6 90 bottom
R14  0R5  [R0402']  31.95,53.5 270 bottom
R15  25.95,26.1 180 bottom
R16  0.47R  [R0402']  9.55,47.2 90 bottom
R17  10k  [R0402']  9.55,45.2 90 bottom
R18  19.15,4.9 90 top
R19  10K  [R0402']  47.55,28 270 bottom
R20  31.15,25.5 180 bottom
R21  1k  [R0402']  34.55,46.1 0 bottom
R22  36.45,21.4 270 top
R23  1.6k  [R0402']  33.35,50 0 bottom
R24  10k  [R0402']  30.95,37 270 bottom
R25  4.7K  [R0402']  47.55,25.8 90 bottom
R26  10k  [R0402']  25.95,42.6 0 bottom
R27  10K  [R0402']  51.95,28.9 90 bottom
R28  23.05,25.5 90 bottom
R29  24.45,25.1 180 bottom
R30  10K  [R0402']  50.75,28.9 90 bottom
R31  10K  [R0402']  47.75,42.3 180 bottom
R32  1K  [R0402']  47.75,39.1 180 bottom
R33  1K  [R0402']  47.75,40.7 180 bottom
R34  4.7K  [R0402']  19.15,9.9 0 top
R35  4.7K  [R0402']  19.15,7.4 0 top
R36  36.85,31.9 0 bottom
R37  37.75,31.9 0 bottom
R38  47K  [R0402']  53.85,25 90 bottom
R39  38.75,31.9 0 bottom
R40  43.45,21.4 270 top
R41  10K  [R0402']  50.95,24.5 180 bottom
R42  45.75,26 180 bottom
R43  45.85,28.6 180 bottom
R44  41.95,28.8 180 bottom
R45  41.95,26.2 180 bottom
R46  0R  [R0402']  25.95,41.6 180 bottom
R47  59.45,19.5 0 top
R48  59.45,13 0 top
R49  59.05,8.4 270 top
R50  49.95,21.4 90 top
R51  59.45,6.4 180 top
R52  34.35,21.4 270 top
R53  40.2,31.45 90 bottom
R55  0R  [R0402']  30.55,58.7 90 bottom
R56  (OPT)2K  [R0402']  41.35,10.8 0 bottom
R57  (OPT)470R  [R0402']  43.95,10.8 180 bottom
RST  27.05,5.9 180 top
RX  16.75,9.9 180 top
SW2  66.6,13.5 90 top
TP6  62.05,30.8 90 bottom
TP7  8.65,26.5 270 bottom
TP8  30.55,28.7 0 bottom
TX  16.75,7.4 180 top
U1  26.95,29.7 180 bottom
U2  58.45,43.1 180 bottom
U3  30.75,41.5 270 bottom
U4  53.25,31.8 270 bottom
U6  56.85,27.1 0 bottom
U8  42.15,8.6 270 bottom
U$1  37.75,27.7 90 bottom
U$2  2.8,16.8 0 top
U$3  2.7,11.4 0 top
U$4  62.25,1.8 0 bottom
U$5  61.85,24.7 0 bottom
U$6  2.85,2.2 0 top
USR  16.75,12.4 180 top
Y1  36.25,43 270 bottom

### Tracks (layer width: path | path; a pad name or v marks a point on that pad's centre or on a via)
3.3V  (via drill 0.3, 0.35)
  Top 0.254: JP2.2 21.55,7.25 22.09,7.79 29.49,7.79 32.36,10.66 | R52.2 v33.1,21.4 32.8,21.4 32.36,20.96 32.36,17.8 | 32.36,17.8 32.36,10.66 | v32.54,17.8 32.36,17.8 | v31.75,36.6 31.75,33 v31.95,32.85 | v33.75,26.15 33.75,26.85 31.9,28.7 v31.55,28.7 31.55,29.7 31.9,30.05 33.95,30.05 v34.2,30.3 | D.B1 29.77,11.32 v30.05,11.6 | v32.47,10.49 32.36,10.59 32.36,10.66
  Top 0.406: v32.95,46.2 30.55,46.2 v30.45,46.1 28.55,46.1 v27.65,45.2
  Top 0.61: C.B1 28.98,17.8 v29.95,17.8
  Top 0.813: v19.65,42.5 v24.45,42.5
  Bottom 0.254: U$1.8 33.99,29.46 C40.2 34,29.5 34,30.1 v34.2,30.3 | C13.2 32.95,47.06 v32.95,46.2 32,45.25 U3.8 | C12.2 v30.45,46.1 30.5,46.05 U3.5 | J4.10 8.5,38.1 8.7,37.9 8.7,37.8 8.5,37.6 J4.9 6.4,37.6 6.2,37.8 6.2,37.9 6.4,38.1 6.8,38.1 | 26.44,43.75 26.49,43.7 26.6,43.7 27.05,43.25 U3.39 | U2.34 arc-90 60.76,34.39 60.76,34.7 | R26.2 24.55,42.6 v24.45,42.5 | R24.2 31.66,36.51 | C38.2 31.95,36.81 v31.75,36.6 | R41.1 50.46,25.4 49.73,26.12 Q8.2 arc90 49.9,26.76 49.9,28.1 49.56,28.45 R19.1 47.16,28.45 46.7,28.9 46.7,31.84 46.76,31.9 46.76,31.93 47.44,32.61 | 47.25,42.25 R31.1 | 31.66,36.51 v31.75,36.6 | 34,32.7 34.4,32.85 | 31.81,36.66 v31.75,36.6 | 31.66,36.51 32.07,36.09 33.17,36.09 34.45,37.37 34.45,41 34.2,41.25 U3.16 | C38.2 31.95,37.41 | R9.2 29.89,28.2 29.42,28.67 | 31.41,28.74 v31.55,28.7 | v33.75,26.15 33.75,22.05 v33.1,21.4 | R45.2 41.2,27.35 41.2,28.75 41.69,29.25 41.9,29.25 | 41.9,29.25 R44.2 42.52,29.86 42.52,30.43 44.9,32.81 45.6,32.81 46.26,33.47 45.86,34.35 | v30.05,11.6 31.35,11.6 v32.47,10.49 | U3.23 C38.2 | U3.40 26.44,43.75 | 26.44,43.75 26.3,43.89 | R53.1 41.3,30.8 41.3,29.85 41.9,29.25
  Bottom 0.305: U1.5 26.95,29.1 27.25,29.4 28.69,29.4 C8.1
  Bottom 0.406: v27.65,45.2 27.65,44.8 26.74,43.89 26.3,43.89 C43.2 | 8.7,37.91 8.7,37.9 8.85,38.05 8.85,39.3 9.15,39.6 C20.1 | 6.2,37.8 6.11,37.84 4.96,37.84 1.68,41.16 1.68,50.34 3.66,52.32 9.25,52.32 10.24,53.3 14.01,53.3 14.8,52.5 20.39,52.5 23.16,49.73 23.16,42.79 23.45,42.5 v24.45,42.5
  Bottom 0.508: C10.1 50.19,32.7
  Bottom 0.61: 60.76,34.7 60.76,35.89 60.15,36.5 53.85,36.5 52.8,35.45 U2.39 | 56.05,51.8 U2.14 | v29.95,17.8 v32.54,17.8 | 50.19,32.7 50.24,32.75 U4.5 52.4,32.75 52.85,33.2 U2.39 | 52.8,34.3 U2.39
  Bottom 0.813: 18.05,42.8 L1.1 | 18.05,42.8 17.95,46.55 C3.1 | C43.2 C14.2 24.45,43.59 v24.45,42.5 | 18.05,42.8 v19.65,42.5 19.96,42.19 19.96,37.97 25.08,32.85 30.95,32.85 | 30.95,32.85 31.5,32.3 | v31.95,32.85 31.5,32.35 | v31.95,32.85 34.4,32.85 35.9,34.35 45.85,34.35 | 30.95,32.85 v31.95,32.85 | 30.95,32.9 31.5,32.35 | 31.5,32.35 31.5,32.3 | C8.1 29.42,28.67 TP8.P$1 31.34,28.67 31.41,28.74 31.5,28.83 31.5,32.3 | 45.85,34.35 45.86,34.35 47.44,32.61 50.1,32.61 C10.1 | 45.85,34.35 47.25,35.76 47.25,39.05 R32.1 R33.1 R31.1 47.3,52.9 47.7,53.3 55.89,53.3 | U2.34 60.85,32.64 C29.2 | 55.89,53.3 C28.2 | U2.14 56.05,53.14 55.89,53.3
BS2
  Bottom 0.254: J4.17 8.7,41.6 9.5,40.8 10.11,40.8 R3.2
BUSY
  Bottom 0.254: J4.16 5.3,41.1 4.2,42.2 4.2,49.3 4.7,49.8 9.85,49.8 10.4,49.25 12.71,49.25 R4.2
BUTTON_MAXRIX
  Top 0.61: 0.A1 59.38,6.98 R51.2 59.45,6.9 59.49,6.95 R49.1 59.5,12.5 R48.2
CS1
  Bottom 0.254: J4.13 7.43,39.62 5.06,39.62 2.98,41.7 2.98,49.81 4.2,51.02 10.47,51.02 R11.2
D/C
  Bottom 0.254: J4.14 5.15,40.1 3.39,41.86 3.39,49.64 4.36,50.61 12.74,50.61 R6.2 arc90 12.64,50.61
DTR  (via drill 0.35)
  Top 0.254: v57.15,30.15 49.25,30.15 v49.1,30.3
  Bottom 0.254: v49.1,30.3 49.73,29.67 Q6.2 50.66,29.39 R30.2 | U6.23 57.6,29.7 v57.15,30.15
EPD_RST
  Bottom 0.254: J4.15 7.43,40.62 5.21,40.62 3.79,42.03 3.79,49.47 4.53,50.21 10.32,50.21 10.58,49.95 10.71,49.95 R5.2
GDR
  Bottom 0.254: J4.23 9.39,44.6 R17.1 10.28,44.76 Q9.1
GND  (via drill 0.3, 0.35)
  Bottom 0.254: U3.7 31.45,42.2 U3.41 v32.45,43.2 33,43.75 U3.11 | v32.45,40.5 arc-90 32.65,40.7 | 32.75,40.2 arc-90 v32.45,40.5 | C16.1 29.89,48.95 30.91,48.95 C25.2 | U6.2 57.4,27.85 57.35,27.9 56.9,27.45 v56.9,27.4 | U3.18 32.75,40.2 | 32.75,40.2 v32.45,40.5 | v32.85,36.7 v32.84,36.71 C38.1 | C12.1 30.45,49.95 30.5,50
  Bottom 0.508: U4.2 55.54,31.75 C9.2
  Bottom 0.6: E2.GND@2 v61,59.45 | E2.GND@3 v61,58.15 | E2.GND@1 v65.8,59.45
  other vias: 29.65,58.95 31.4,58.95 29.8,49.9 29.8,51.05 31,51.05 31,49.9 32.95,48.9 33.95,48.9 36.35,46.3 35.55,45.3 30.75,41.4 29.05,43.2 28.95,39.7 37.65,27.7 33.95,27.7 31.95,24.55 29.3,24.6 24.25,20.9 57.1,31.5 58.65,53.5 24.75,46.5 26.15,46.5 47,5.7 52.85,5.6 46.55,9.2 38.8,10.35 41.7,8.55 39.85,8.6 58.65,9.2 59.5,59.45 61.05,56.9 61.05,55.3 61.05,53.5 62.2,53.5 63.45,53.5 64.65,53.45 65.75,53.5 65.75,55.3 65.75,56.85 12.9,43.6 12.9,42.8 12.9,42 12.9,41.15 12.9,40.25 12.9,39.35 12.9,38.55 12.9,37.65 12.9,36.75 12.9,35.95 12.9,33.15 12.9,31.15 19.15,32.25 25.6,29.7 26.4,29.7 29.35,31.25 27,31.9 19.85,34.25 26.9,26.25 52,26.45 40.25,30.3 59.6,29.75 53.3,31.8 48.95,31.2 37.05,40.5 23.9,40.55 24.95,38.8 26.5,37.3 26.55,40.6 30.35,30.3 30.95,27.15 32,27.2 35.2,30.25 51.85,31.75 50.15,33.75 45.8,29.9 45.8,30.8 44.8,29.9 43.9,32.9 62.4,26.5 62.4,25.4 62.4,24.5 68.4,50.4 68.4,48.7 65.8,48.7 65.7,50.3 64.1,50.4 68.4,52.5 68.2,55 68.2,56.2 68.9,54.1 68.9,57 68,58.8 56.4,44.8 56.4,47.4 57.7,46.1 55.1,46.1 59.1,46.1 60.4,47.4 60.4,44.8 61.7,46.1 56.4,38.8 57.7,40.1 56.4,41.4 55.1,40.1 59.1,40.1 60.4,41.4 60.4,38.8 61.7,40.1 4.2,11.1 24.4,23.85 29.8,52.85 31,52.85 7.35,47.7 5.15,45.8 5.85,29 7.35,31 5.85,32.8 4.25,30.9 6.05,37 8.75,47.7 8.75,45.7 9.55,48.5 10.45,47.7 9.55,38.7 15.4,46.6 58.2,33.1 59.2,35.6 33.75,44.5 16.5,47.65 18.15,40.8 19,40.8 18.2,38.6 19,38.6 29.2,45.35 27.95,53.7 27.95,52.7 27.95,51.7 27.95,50.7 27.95,49.7 27.95,48.7 27.95,47.7 27.95,46.7 33,53.7 33,52.7 33,51.7 34,51.2 35,50.7 36,50.2 36,49.2 36,48.2 36,47.2 16.2,11.5 16.15,4 4.15,14.1 2.35,13.05
  pour Bottom (rank 2): -1.05,-0.7 71.85,-0.7 71.65,52.9 71.65,57.35 70.65,57.3 70.55,60 59.2,60 59.2,53.9 32.05,53.9 32.05,59.55 28.95,59.55 28.95,53.9 -1.15,53.9
  pour Top (rank 2): -1.35,-0.9 71.55,-0.9 71.35,50.8 71.3,55.2 70.65,55.2 70.55,60 59.2,60 59.2,53.9 -1.55,53.9
  pour Top (no thermals): 28.95,59.55 32.05,59.55 32.05,58.5 28.95,58.5
  pour Bottom (no thermals): 59.9,61.55 72.75,61.55 72.75,47.85 63.1,47.85 63.1,52.75 59.9,52.75
  pour Bottom (rank 2, no thermals): 3.45,13.7 6.3,13.7 6.3,11.45 3.45,11.45
GPIO0  (via drill 0.35)
  Top 0.254: v42.3,38.08 43.5,38.08 43.68,37.9 55.35,37.9 v55.6,38.15 | v36.45,37.88 36.43,37.88 36.35,37.91 35.46,37.91 34.95,37.4 v30.2,37.4
  Bottom 0.254: v30.2,37.4 R24.1 31,37.5 U3.25 | v36.45,37.88 37.92,37.88 38.4,38.31 42.07,38.31 v42.3,38.08 | v55.6,38.15 55.67,38.08 56.81,38.08 57.2,38.47 57.7,38.47 58.09,38.08 64.58,38.08 64.99,38.49 64.99,46.14 65.95,47.1 U2.23
GPIO29  (via drill 0.35)
  Top 0.254: v36,33.15 35.85,33.3 v35.85,37.3 35.85,37.35 | v43.3,37.27 43.54,37.03 43.54,36.61 44.3,35.85 v48.6,35.85
  Bottom 0.254: R1.1 v36,33.15 | 35.85,37.07 34.72,37.07 33.34,35.68 26.34,35.68 22.68,39.34 22.68,49.53 20.19,52.02 14.61,52.02 14.03,52.6 R13.1 | 35.85,37.07 38.01,37.07 38.45,37.51 39,37.51 39.44,37.07 43.1,37.07 v43.3,37.27 | v35.85,37.3 35.85,37.07 | v43.3,37.27 | v48.6,35.85 49.6,35.85 U2.1
GPIO30  (via drill 0.35)
  Top 0.254: v45.35,33.42 46.31,33.42 v47.3,34.35
  Bottom 0.254: R36.1 36.8,33.35 37.11,33.67 45.15,33.67 v45.35,33.42 | v47.3,34.35 47.95,35 47.95,37.05 48.4,37.5 U2.2
GPIO31  (via drill 0.35)
  Top 0.254: v38.75,36.9 38.75,33.6 v38.2,33.05 | v44.15,36.86 44.46,36.86 44.66,37.06 55.4,37.06 56.61,35.85 56.61,35.35 56.25,34.99 55.75,34.99 55.19,35.55 v54.4,35.55
  Bottom 0.254: 38.85,36.66 34.89,36.66 33.51,35.28 26.17,35.28 22.28,39.17 22.28,49.36 20.02,51.61 13.93,51.61 R12.1 | R37.1 v38.2,33.05 | v38.75,36.9 38.85,36.66 | v44.15,36.86 43.95,36.66 38.85,36.66 | v54.4,35.55 U2.38
GPIO32  (via drill 0.35)
  Top 0.254: v44.91,36.46 55.14,36.46 v56,35.6
  Bottom 0.254: 11.65,51.21 11.64,51.2 arc-90 R11.1 11.74,51.21 19.85,51.21 21.87,49.19 21.87,39.01 26,34.87 33.67,34.87 35.06,36.26 44.71,36.26 v44.91,36.46 | v56,35.6 U2.37
GPIO33  (via drill 0.35)
  Top 0.254: v45.86,46.3 v48.25,46.3
  Bottom 0.254: v48.25,46.3 50.48,46.3 51.3,47.12 51.3,48.95 51.68,49.33 61.28,49.33 62.45,50.5 U2.18 | v45.86,46.3 46.06,46.1 46.06,36.1 45.4,35.44 35.4,35.44 34.01,34.06 25.67,34.06 21.06,38.67 21.06,48.86 19.52,50.4 14.54,50.4 14.1,49.95 11.69,49.95 R5.1
GPIO34  (via drill 0.35)
  Top 0.254: v46.37,47.85 v48.25,47.85
  Bottom 0.254: R4.1 14.15,49.3 14.84,49.99 19.35,49.99 20.65,48.69 20.65,38.5 25.5,33.65 34.18,33.65 35.57,35.04 45.57,35.04 46.46,35.94 46.46,47.81 v46.37,47.85 | v48.25,47.85 48.3,47.9 50.55,47.9 50.85,48.2 50.85,49.25 51.34,49.74 59.94,49.74 60.85,50.65 U2.17
GPIO36  (via drill 0.35)
  Top 0.254: v45.3,49.55 v48.3,49.55
  Bottom 0.254: R6.1 13.8,50.55 14.05,50.8 19.69,50.8 21.46,49.03 21.46,38.84 25.84,34.46 33.84,34.46 35.23,35.85 45.23,35.85 45.65,36.27 45.65,45.65 45.25,46.05 45.25,49.5 v45.3,49.55 | v48.3,49.55 48.37,49.62 50.5,49.62 51.02,50.15 56.84,50.15 57.65,50.95 U2.15 57.65,51.8 57.6,51.75
GPIO37  (via drill 0.35)
  Top 0.254: v48.3,51.4 v45.45,51.4 | v43.29,41.35 41.15,39.21 41.15,32.95 43.37,30.73 v43.37,24.77 43.37,24.04 43.15,23.81 32.71,23.81 31.93,23.03 30.86,23.03 30.33,22.5 30.33,21 30.24,21 v30.03,20.79 | v28.95,14.6 D.A1
  Bottom 0.254: v48.3,51.4 48.72,50.98 50.5,50.98 50.93,50.55 54.1,50.55 54.45,50.9 U2.13 | v45.45,51.4 45.11,51.06 44.6,51.06 43.63,50.09 43.63,48.45 43.83,48.25 43.83,46.13 43.19,45.48 43.19,43.21 43.49,42.91 43.49,41.55 v43.29,41.35 | v43.37,24.77 43.35,24.75 43.54,24.56 43.54,22.55 43.9,22.19 45.27,22.19 47.34,24.26 48.59,24.26 Q8.3 | v30.03,20.79 29.83,20.59 29.71,20.59 28.95,19.83 v28.95,14.6
GPIO39  (via drill 0.35)
  Top 0.254: v39.7,33.05 v39.7,37.7 | v44.85,50.45 v48.3,50.45
  Bottom 0.254: R39.1 38.75,32.6 39.2,33.05 v39.7,33.05 | v39.7,37.7 40.03,37.48 42.65,37.48 43.05,37.88 44.74,37.88 45.25,38.38 45.25,45.48 44.84,45.88 44.84,49.15 44.69,49.3 44.69,50.29 v44.85,50.45 | v48.3,50.45 49.5,50.45 U2.10
GPIO57  (via drill 0.3, 0.35)
  Top 0.254: R7.2 19.54,11.63 20.91,10.27 20.91,9.57 21.06,9.41 28.81,9.41 30.74,11.34 30.74,21.84 31.22,22.33 v31.1,22.45 | v39.63,40.54 39.7,40.54 39.61,40.45 39.61,39.88 39.25,39.53 38.89,39.53 37.46,38.1 37.46,37.36 37.06,36.95 37.06,32.38 37.01,32.34 37.01,32.29 36.22,31.5 34.05,31.5 v33.65,31.1 | v44.24,48.7 v48.25,48.7
  Bottom 0.254: 33.05,24.08 33.06,24.07 | v31.1,22.45 32.15,23.5 32.52,23.5 33.05,24.03 33.05,24.08 | v39.63,40.54 42.58,40.54 42.78,40.74 43.6,40.74 43.9,41.04 43.9,43.08 43.66,43.31 | 43.66,43.31 43.59,43.38 | v48.25,48.7 U2.9 | v44.24,48.7 44.24,45.86 43.59,45.22 43.59,43.48 43.66,43.41 43.66,43.31 | v33.65,31.1 33.05,30.5 33.05,24.08
GPIO58  (via drill 0.35)
  Top 0.254: 59.6,6.15 59.65,6.1 R51.1 59.49,6 60.15,6 60.4,6.25 60.4,20.25 59.35,21.4 56.85,21.4 55.55,22.7 v54.15,22.7 | v48.67,47.08 42.84,47.08 v42.82,47.1 | v41.55,24.83 42.35,25.63 42.35,30.6 40.34,32.61 40.34,39.55 41.64,40.85 v41.64,41.41
  Bottom 0.254: U2.8 48.64,47.1 v48.67,47.08 | v42.82,47.1 42.82,46.46 42.38,46.02 42.38,42.15 v41.64,41.41 | v41.55,24.83 41.86,24.52 41.86,23.09 43.56,21.38 45.61,21.38 47.67,23.45 53.41,23.45 v54.15,22.7
GPIO59  (via drill 0.3, 0.35)
  Top 0.254: v38.85,40.13 38.83,40.13 37.06,38.36 37.06,37.52 36.65,37.12 36.65,32.55 36,31.9 33.4,31.9 v32.9,31.4 | v44.59,45.2 44.84,45.45 v48.25,45.45
  Bottom 0.254: R8.1 26.54,24.51 27,23.9 32.35,23.9 32.64,24.2 32.64,31.15 v32.9,31.4 | U2.7 48.3,45.5 v48.25,45.45 | 38.85,39.93 38.85,40.1 | 38.85,40.1 v38.85,40.13 | v44.59,45.2 44.49,45.19 44,44.7 44,43.65 44.3,43.35 44.3,40.63 44.01,40.33 42.95,40.33 42.55,39.93 39.02,39.93 38.85,40.1
GPIO60  (via drill 0.35)
  Top 0.254: v44.61,43.9 v48.3,43.9 | v27.35,36.29 27.41,36.31 27.41,36.77 29.61,38.82 30.79,38.82 30.93,38.68 34.5,38.68 35.56,39.73 v37.5,39.73
  Bottom 0.254: R46.1 23.3,41.6 23.09,41.39 23.09,39.51 26.51,36.09 27.15,36.09 v27.35,36.29 | v27.35,36.29 | v37.5,39.73 37.7,39.53 42.71,39.53 43.12,39.93 44.18,39.93 44.71,40.46 44.71,43.7 44.61,43.85 v44.61,43.9 | v48.3,43.9 U2.6
MOSI
  Bottom 0.254: J4.11 7.43,38.62 4.91,38.62 2.17,41.36 2.17,50.14 3.86,51.83 9.55,51.83 10.32,52.6 R13.2
N$1
  Bottom 0.254: U3.14 34.3,42.25 35.05,43 36.35,43 37.12,43.77 Y1.2 37.27,45.47 C11.2
N$2
  pour Bottom (no thermals): 26.25,30.4 20.25,30.4 20.25,31.8 26.25,31.8
N$4
  Bottom 0.61: C23.1 16.75,37.1 16.55,36.9 D2.- D1.+
N$5
  Bottom 1.27: U$4.P$1 63.65,18.9 66.65,15.9 68.17,15.9 SW2.3
N$6
  Top 0.254: USR.+ R7.1
N$7
  Bottom 0.305: U1.4 27.9,27.2 R10.2 27.99,27.1 R9.1
N$8  (via drill 0.3)
  Top 0.254: v29.05,25.5 28.6,25.95 28.55,26 v28.55,31.25
  Bottom 0.254: v28.55,31.25 28.5,31.25 28.4,31.15 27.9,31.15 U1.3 | R15.1 26.25,25.3 28.2,25.3 | v29.05,25.5 28.85,25.3 28.2,25.3 | Q3.3 28.2,25.13 28.2,25.3
N$9
  Bottom 0.254: U3.15 35.21,41.75 Y1.4 35.23,40.57 C15.2
N$10
  Bottom 0.254: U3.6 31,45.59 L4.2
N$11
  Bottom 0.254: U3.4 30,45.49 L2.2
N$12
  Bottom 0.305: J4.7 9.24,36.65 C4.1
N$13
  Bottom 0.406: L2.1 arc-90 28.91,48.01 C16.2 28.91,50 arc90 C26.1
N$14
  pour Bottom (no thermals): 16.2,40.05 13.7,40.05 13.7,44.15 12.4,45.45 12.4,46.75 13.9,46.75 16.2,44.45
N$15
  Bottom 0.406: L4.1 arc90 31.89,48.01 C25.1 31.89,50 arc-90 C33.1 32.85,50.01 arc-90 R23.2
N$16
  Bottom 0.254: C36.2 34.06,47.05 R21.2 33.61,45.6 33.05,45.6 32.5,45.05 U3.9
N$17
  Bottom 0.254: C37.1 34.94,47.05 R21.1 34.85,45.96 34.85,45.5 34.45,45.1 33.25,45.1 33,44.85 U3.10
N$18
  Bottom 0.406: R23.1 34.25,50 arc-90 34.95,49.3 34.95,48.05 arc90 C37.2
N$19
  Top 0.61: 4.B0 35.03,11.32 36.25,10.1 36.25,5.5 36.93,4.82 7.B1
N$20
  Bottom 0.406: L7.1 67.15,57.05 arc-90 C41.2 arc90 65.91,58.15 E2.FEED
N$21
  Top 0.61: 1.B0 35.23,17.82 36.15,16.9 36.15,11.9 36.75,11.3 38.03,11.3 4.B1
N$22
  Bottom 1.27: SW2.2 63.2,11.62 U$4.P$2
N$23  (via drill 0.35)
  Top 0.254: v53.35,30.8 57.7,30.8 v58.1,31.2
  Bottom 0.254: U4.3 v53.35,30.8
  Bottom 0.406: 54.51,32.71 U4.1 56.14,32.75 C9.1 56.24,32.71 56.25,32.7 57.35,32.7 58.1,31.95 v58.1,31.2 58.4,30.9 D6.C
N$24
  Bottom 0.406: U8.5 40.86,9.5 R56.2
N$25
  Top 0.61: 5.B0 41.43,11.32 42.65,10.1 42.65,5.6 43.45,4.8 44.53,4.8 8.B1
N$26
  Bottom 0.406: U2.20 arc90 67.16,53.31 C42.2 arc-90 67.15,54.11 L7.2
N$27
  Bottom 0.254: U$1.10 36.5,30.81 R1.2
N$28
  Bottom 0.254: U$1.11 37,31.31 R36.2
N$29
  Bottom 0.254: U$1.12 37.5,31.21 R37.2
N$30
  Bottom 0.254: U$1.13 38,30.71 R39.2 R53.2
N$32
  Top 0.61: 2.B0 41.73,17.82 42.65,16.9 42.65,12 43.35,11.3 44.53,11.3 5.B1
N$33
  Top 0.61: R22.1 R40.2 43,18.25 43.45,17.8 44.53,17.8 2.B1
N$34
  Top 0.61: 6.B0 48.03,11.32 49.15,10.2 49.15,5.7 50.05,4.8 51.03,4.8 9.B1
N$35
  Top 0.61: 3.B0 48.13,17.82 49.15,16.8 49.15,12 49.85,11.3 51.03,11.3 6.B1
N$36
  Top 0.61: R40.1 R50.1 49.5,18.35 50.05,17.8 51.03,17.8 3.B1
N$37
  Top 0.61: DEL.B0 54.53,11.32 55.65,10.2 55.65,5.6 56.45,4.8 57.53,4.8 0.B1
N$38
  Top 0.61: ENTER.B0 54.53,17.82 55.75,16.6 55.75,11.9 56.35,11.3 57.53,11.3 DEL.B1
N$39
  Top 0.61: R50.2 55.35,21.4 56.05,20.7 56.05,18.2 56.45,17.8 57.53,17.8 ENTER.B1
N$40
  Top 0.254: PWR.+ R18.1
N$41
  Top 0.254: R18.2 JP2.1
N$42
  Bottom 0.406: J3.1 64.6,28.6 64.2,29 F1.2
N$43
  Bottom 0.254: R30.1 50.7,27.43 Q5.1
N$44  (via drill 0.35)
  Top 0.254: v52.72,29.42 52.49,29.4 v47.55,29.4
  Bottom 0.254: R27.2 52.55,29.35 v52.72,29.42 | v47.55,29.4 48.45,29.4 Q6.1
N$45
  Bottom 0.254: Q6.3 49.05,27.56 R19.2 R25.2
N$46
  Bottom 0.254: R25.1 48.06,25.36 48.46,25.77 Q8.1
N$47
  Top 0.254: R35.1 TX.+
N$48
  Top 0.254: R34.1 RX.+
N$49  (via drill 0.35)
  Top 0.254: TX.- 16.8,6.7 20.1,6.7 20.5,7.1 20.5,7.8 20.89,8.2 29.32,8.2 31.96,10.83 31.96,21.33 33.22,22.6 43.31,22.6 43.75,22.15 44.6,22.15 45.04,22.6 53.04,22.6 54.85,24.4 v54.8,24.39
  Bottom 0.254: v54.8,24.39 U6.13
N$50  (via drill 0.35)
  Top 0.254: RX.- 16.8,10.6 20,10.6 20.5,10.1 20.5,9.4 20.89,9.01 28.98,9.01 31.14,11.17 31.14,21.67 32.88,23.41 52.51,23.41 52.89,23.8 52.89,25.95 52.69,26.15 52.69,26.65 52.89,26.85 52.89,27.01 v52.83,27.07
  Bottom 0.254: v52.83,27.07 52.89,27.01 53.55,27.01 54.21,26.35 U6.14
N$51
  Bottom 0.254: R38.1 53.8,23.8 53.95,23.65 56.55,23.65 57.1,24.2 U6.9
N$52  (via drill 0.35)
  Top 0.254: v54.15,29.51 53.45,28.81 53.45,28.19 53.09,27.84 48.09,27.84 45.85,25.6 v45.85,24.7
  Bottom 0.254: Q1.2 45.34,25.1 R42.1 45.85,25.41 v45.85,24.7 | v54.15,29.51 54.26,29.51 54.55,29.8 55.91,29.8 56.1,29.6 U6.20
N$53  (via drill 0.35)
  Top 0.254: v52.84,28.44 47.74,28.44 v46.6,27.3
  Bottom 0.254: Q7.2 45.39,27.7 45.8,28.1 | 45.8,28.1 R43.1 | v46.6,27.3 45.8,28.1 | v52.84,28.44 52.84,28.69 53.33,29.17 53.33,29.58 53.95,30.2 56.2,30.2 56.6,29.8 U6.21
N$54
  Top 0.61: 6.A1 DEL.A0
N$55
  Top 0.61: 3.A1 ENTER.A0
N$56
  Top 0.61: 7.A1 8.A0
N$57
  Top 0.61: 8.A1 9.A0
N$58
  Top 0.61: 9.A1 0.A0
N$59
  Top 0.61: 4.A1 5.A0
N$60
  Top 0.61: 5.A1 6.A0
N$61
  Top 0.61: DEL.A1 59.41,13.48 R48.1 R47.2
N$62
  Top 0.61: 1.A1 2.A0
N$63
  Top 0.61: 2.A1 3.A0
N$64
  Top 0.61: ENTER.A1 59.41,19.98 R47.1
N$65  (via drill 0.3, 0.35)
  Top 0.254: v31.05,55.8 31.1,55.8
  Top 0.5: v34.45,90.5 arc90 15.05,70.15 15.05,57.1 17.35,54.8 v28.85,54.8 | v35.85,89.4 arc-90 54.45,70.15 54.45,57.8 52.45,55.8 31.1,55.8 | v34.45,88.4 arc90 17.05,70.15 17.05,57.9 18.15,56.8 v29.95,56.8 | v35.85,87.2 arc-90 52.45,70.15 52.45,58.5 51.75,57.8 v30.55,57.8 18.75,57.8 18.05,58.5 18.05,70.15 arc-90 34.45,87.2 35.85,88.4 arc-90 53.45,70.15 53.45,58.1 52.15,56.8 31.05,56.8 29.95,55.8 17.75,55.8 16.05,57.5 16.05,70.15 arc-90 34.45,89.4 35.85,90.5 arc-90 55.45,70.15 55.45,57.5 52.75,54.8 v31.95,54.8
  Bottom 0.254: v31.05,55.8 30.95,55.8
  Bottom 0.5: R14.1 v31.95,54.8 | R2.1 28.8,54.35 v28.85,54.8 | v34.45,90.5 v35.85,89.4 | v34.45,88.4 v35.85,87.2 | 30.95,55.8 v29.95,56.8
  Bottom 0.61: v30.55,57.8 R55.1
N$66
  pour Bottom (no thermals): 6.65,12.4 7.85,12.4 9.85,10.4 10.6,10.4 10.6,9.45 3.9,9.45 3.9,10.45 4.7,10.45
N$69
  Bottom 0.406: U8.1 43.46,9.5 R57.1
N$70
  Bottom 0.406: R57.2 CHARGE.-
N$71
  Top 0.254: R52.1 R22.2
  Top 0.61: R22.2 36,18.75 36.95,17.8 38.03,17.8 1.B1
N$72
  Bottom 0.406: D5.A 43.4,7.6 U8.3 43.45,7.64 C39.2 49.9,7.64 J1.2
N$74
  Top 0.61: B.B1 C.B0
N$75
  Top 0.61: A.B1 B.B0
N$76  (via drill 0.3)
  Top 0.61: A.A1 15.43,19.98 14.25,18.8 14.25,17 16.45,14.8 26.25,14.8 27.05,14 27.05,12.7 v27.15,12.6 | v32.05,7.7 32.77,6.98 7.A0
  Bottom 0.61: v27.15,12.6 v32.05,7.7
N$77  (via drill 0.3)
  Top 0.61: B.A1 20.95,18.58 20.95,17.2 22.15,16 v29.95,16 | v34.15,16 34.15,13.5 34.07,13.48 4.A0
  Bottom 0.61: v29.95,16 v34.15,16
N$78  (via drill 0.3)
  Top 0.61: C.A1 arc-90 28.98,20 v29.95,20 | v33.15,20 arc90 33.17,19.98 1.A0
  Bottom 0.61: v29.95,20 v33.15,20
PMU_EN_WF
  Bottom 0.254: U2.5 R31.2
PREVGH
  Bottom 0.254: 8.7,35.1 9.7,34.1 14.5,34.1 14.7,34.3 14.7,34.89 C24.1
  Bottom 0.305: J4.4 8.65,35.15 8.7,35.1
  Bottom 0.61: D3.- 14.76,36.84 C24.1
PREVGL
  Bottom 0.254: 16.5,32.29 C18.1 16.39,32.1 9.6,32.1 9.11,32.59 9.11,33.41 8.38,34.15 J4.2
  Bottom 0.61: D2.+ 16.5,32.29
RESE
  Bottom 0.254: J4.22 6.4,44.1 6.1,44.4 6.1,45.5 6.3,45.7 7.2,45.7 8.2,46.7 9.5,46.7 R16.1 Q9.2
RFTX1
  Bottom 0.406: 28.95,51.85 C26.2 | 28.95,51.85 R2.2 | C34.2 28.91,51.91 arc-90 28.95,51.85
RFTX2
  Bottom 0.152: 31.94,51.61 31.94,51.95 31.95,51.95
  Bottom 0.406: C33.2 31.95,51.95 R14.2 | C35.1 31.94,51.61
RSTPDN
  Bottom 0.254: R46.2 R26.1 arc-90 26.49,42.7 26.54,42.75 U3.38
RTS
  Bottom 0.254: U6.19 54.6,29.1 54.1,28.6 54.1,28.15 53.7,27.75 53,27.75 | R27.1 51.93,28.43 51.93,27.75 | Q5.2 51.93,27.75 | 53,27.75 51.93,27.75 | 53,27.75
SCL  (via drill 0.35)
  Top 0.254: v29.58,36.88 29.59,36.89 29.59,37.65 29.95,38.01 30.45,38.01 30.6,37.86 34.84,37.86 35.49,38.52 v35.85,38.52 | v44.1,38.92 45.89,40.7 v51,40.7
  Bottom 0.254: v29.58,36.88 29.59,36.89 29.59,37.65 30,38.06 U3.27 | v44.1,38.92 43.9,38.71 38.03,38.71 37.83,38.52 v35.85,38.52 | v51,40.7 U2.4 R33.2
SCLK
  Bottom 0.254: J4.12 7.43,39.12 4.98,39.12 2.57,41.53 2.57,49.97 4.03,51.43 9.88,51.43 10.35,51.9 R12.2
SDA  (via drill 0.35)
  Top 0.254: v28.77,36.9 28.8,36.9 28.97,37.07 28.97,37.61 29.78,38.41 30.62,38.41 30.76,38.27 34.67,38.27 35.52,39.12 v36.58,39.12 | v51,39.1 50.78,39.32 45.37,39.32 44.35,38.31 43.85,38.31 43.49,38.66 43.49,39.19 v43.37,39.32
  Bottom 0.254: v28.77,36.9 28.97,37.1 28.97,37.61 29.36,37.99 | 29.36,37.99 29.45,38.08 | v36.58,39.12 36.61,39.1 36.59,39.1 36.61,39.12 43.15,39.12 43.35,39.32 v43.37,39.32 | v51,39.1 U2.3 R32.2 | U3.28 29.5,38.13 29.36,37.99
SYS_RST_N  (via drill 0.35)
  Top 0.254: v48.3,52.3 45.35,52.3 v45.3,52.35 | RST.A1 RST.A0 30.45,6.32 30.45,8.18 32.15,9.88 32.72,9.88 33.07,10.23 33.07,10.74 32.77,11.04 32.77,17.21 33.12,17.56 33.12,18.04 32.77,18.39 32.77,18.7 v32.97,18.7 | v29.72,21.6 29.92,21.8 29.92,22.67 30.69,23.44 31.76,23.44 32.55,24.22 41.93,24.22 v42.46,24.75 42.56,24.97 42.97,25.37 42.97,30.56 40.74,32.78 40.74,39.38 42.48,41.12 v42.48,41.4
  Bottom 0.254: C27.1 52.8,24.5 R41.2 | R41.2 Q5.3 | U2.11 48.75,51.85 v48.3,52.3 | v45.3,52.35 44.41,51.46 44.43,51.46 43.23,50.26 43.23,48.28 43.42,48.08 43.42,46.4 42.78,45.75 42.78,43.05 43.08,42.74 43.08,42 v42.48,41.4 | v42.46,24.75 42.49,24.6 43.14,24 43.14,22.38 43.73,21.79 45.44,21.79 47.51,23.85 51.2,23.85 51.35,24 51.35,24.46 R41.2 | v29.72,21.6 30.07,21.6 31.08,20.59 33.39,20.59 33.73,20.24 33.73,19.76 32.97,18.99 v32.97,18.7
UART_RX  (via drill 0.35)
  Top 0.254: v57.45,37.86 57.42,37.83 57.42,35.01 56.59,34.18 54.34,34.18 52.88,35.64 50.5,35.64 46.76,31.9 | 46.76,31.9 | v45.3,32.2 v45.29,32.2 45.8,31.64 46.5,31.64 46.76,31.9
  Bottom 0.254: R44.1 41.91,28.35 Q7.3 42.92,29.93 v45.3,32.2 | v57.45,37.86 57.65,37.66 64.73,37.66 65.39,38.32 65.39,43.25 66.05,43.9 U2.25
UART_TX  (via drill 0.35)
  Top 0.254: v56.75,37.29 56.75,36.28 57.01,36.02 57.01,35.18 56.42,34.59 54.5,34.59 53.04,36.05 50.05,36.05 v46.25,32.3
  Bottom 0.254: R45.1 41.91,25.75 Q1.3 | U2.26 66.2,42.3 65.8,41.9 65.8,38.25 65.85,38.2 64.9,37.25 56.75,37.25 v56.75,37.29 | v46.25,32.3 43.85,29.85 43.74,29.74 43.74,26.57 Q1.3 | 43,25.75 Q1.3
USB_D+
  Bottom 0.254: J3.3 58.85,27.3 U6.3
USB_D-  (via drill 0.35)
  Top 0.254: v59.9,27.91 59.9,26.79 v59.8,26.69
  Bottom 0.254: J3.2 59.94,27.95 v59.9,27.91 | v59.8,26.69 59.64,26.85 U6.4
V_BATT
  Bottom 0.305: Q2.1 7.22,18.64 6.95,18.9 6.95,18.65 U$4.P$4
  pour Bottom (no thermals): 26.25,26.5 20.25,26.5 20.25,29 26.25,29
  pour Bottom (no thermals): 3.7,23.45 8,27.75 17.8,27.75 19.05,29 22.95,29 22.95,25.7 20.25,23.1 12.4,23.1 10.8,21.45 10.75,15.4 3.65,15.4
V_USB  (via drill 0.35)
  Top 0.254: v32.04,25.95 29.52,23.43 29.52,22.5 28.95,21.93 v28.95,21.1
  Top 0.508: v60.45,29.2 60.75,28.9 60.75,25.7 v59.76,24.71
  Top 0.6: v61.85,13.5 61.88,13.57 61.88,20.59 60.05,22.42 60.05,24.42 v59.76,24.71
  Bottom 0.254: Q3.1 31.09,25.95 R20.2 31.2,25.95 v32.04,25.95 | U6.8 U6.7 58.5,24.65 59.82,24.65 | C32.2 60.75,24.65 | 60.75,24.65 C31.2 | 59.82,24.65 60.75,24.65 | 59.82,24.65 v59.76,24.71 | v28.95,21.1 28.95,21 28.15,20.2 28.15,13.7 29.05,12.8 34.75,12.8 36.9,10.65 | CHARGE.+ 46.7,12.45 46.75,12.5 | TP6.P$1 61.15,30.85 D6.A | TP6.P$1 61.59,30.38 | 61.59,30 TP6.P$1
  Bottom 0.406: C44.2 38.8,7.6 U8.4 41.1,7.6 D5.C
  Bottom 0.508: F1.1 61.55,29.2 v60.45,29.2 | C44.2 37.44,7.84 37.4,7.8 36.9,8.3 36.9,10.65 38.75,12.5 46.75,12.5 60.85,12.5 v61.85,13.5
  Bottom 0.6: F1.1 61.59,30 61.59,30.38 61.59,30.41 D6.A
VBAT_SENSE
  Bottom 0.254: 24.49,25.5 R28.1 | 24.49,25.5 R8.2 | R29.2 24.49,25.5
VCC  (via drill 0.35)
  Top 0.254: 20.69,8.6 29.15,8.6 31.55,11 31.55,21.5 33.05,23 44.15,23 | R34.2 19.54,9.75 20.69,8.6 | R35.2 19.54,7.45 20.69,8.6 | v59.75,25.85 58.67,25.85 58.07,25.25 53.45,25.25 | 53.45,25.25 53.45,23.78 52.67,23 44.15,23 | v53.3,26.4 53.45,26.25 53.45,25.25 | v44.15,22.8 44.15,23
  Bottom 0.254: R42.2 44.78,26.4 Q1.1 44.62,26.25 44.15,26.25 | R43.2 44.78,29 Q7.1 44.15,28.37 44.15,26.25 | C30.2 60.16,25.85 v59.75,25.85 U6.6 U6.5 | R38.2 53.8,25.9 v53.3,26.4 | v44.15,22.8 v44.15,22.81 44.15,26.25
VCOM
  Bottom 0.254: 8.33,33.48 8.2,33.6 | 8.33,33.48 8.6,33.2 8.6,32.5 9.5,31.6 9.89,31.6 C19.1 | J4.1 8.15,33.65 8.33,33.48
VGH
  Bottom 0.254: J4.20 8.5,43.1 9.6,42 10.29,42 C22.1
VGL
  Bottom 0.254: J4.21 10.09,43.6 C21.1
VPP
  Bottom 0.305: J4.6 10.14,36.15 C5.1
VSH
  Bottom 0.305: J4.5 9.74,35.65 C6.1
VSL
  Bottom 0.254: C7.1 10.19,33.3 9.8,33.3 8.5,34.6
  Bottom 0.305: J4.3 8.45,34.65 8.5,34.6

### Text on the board
tPlace: Hitcon Badge 2018 V3.1 | ON | OFF
bNames: VUSB | VBAT